# EAGLE schematic UNOWiFiREV2V4.0 (EAGLE 9.4.2)
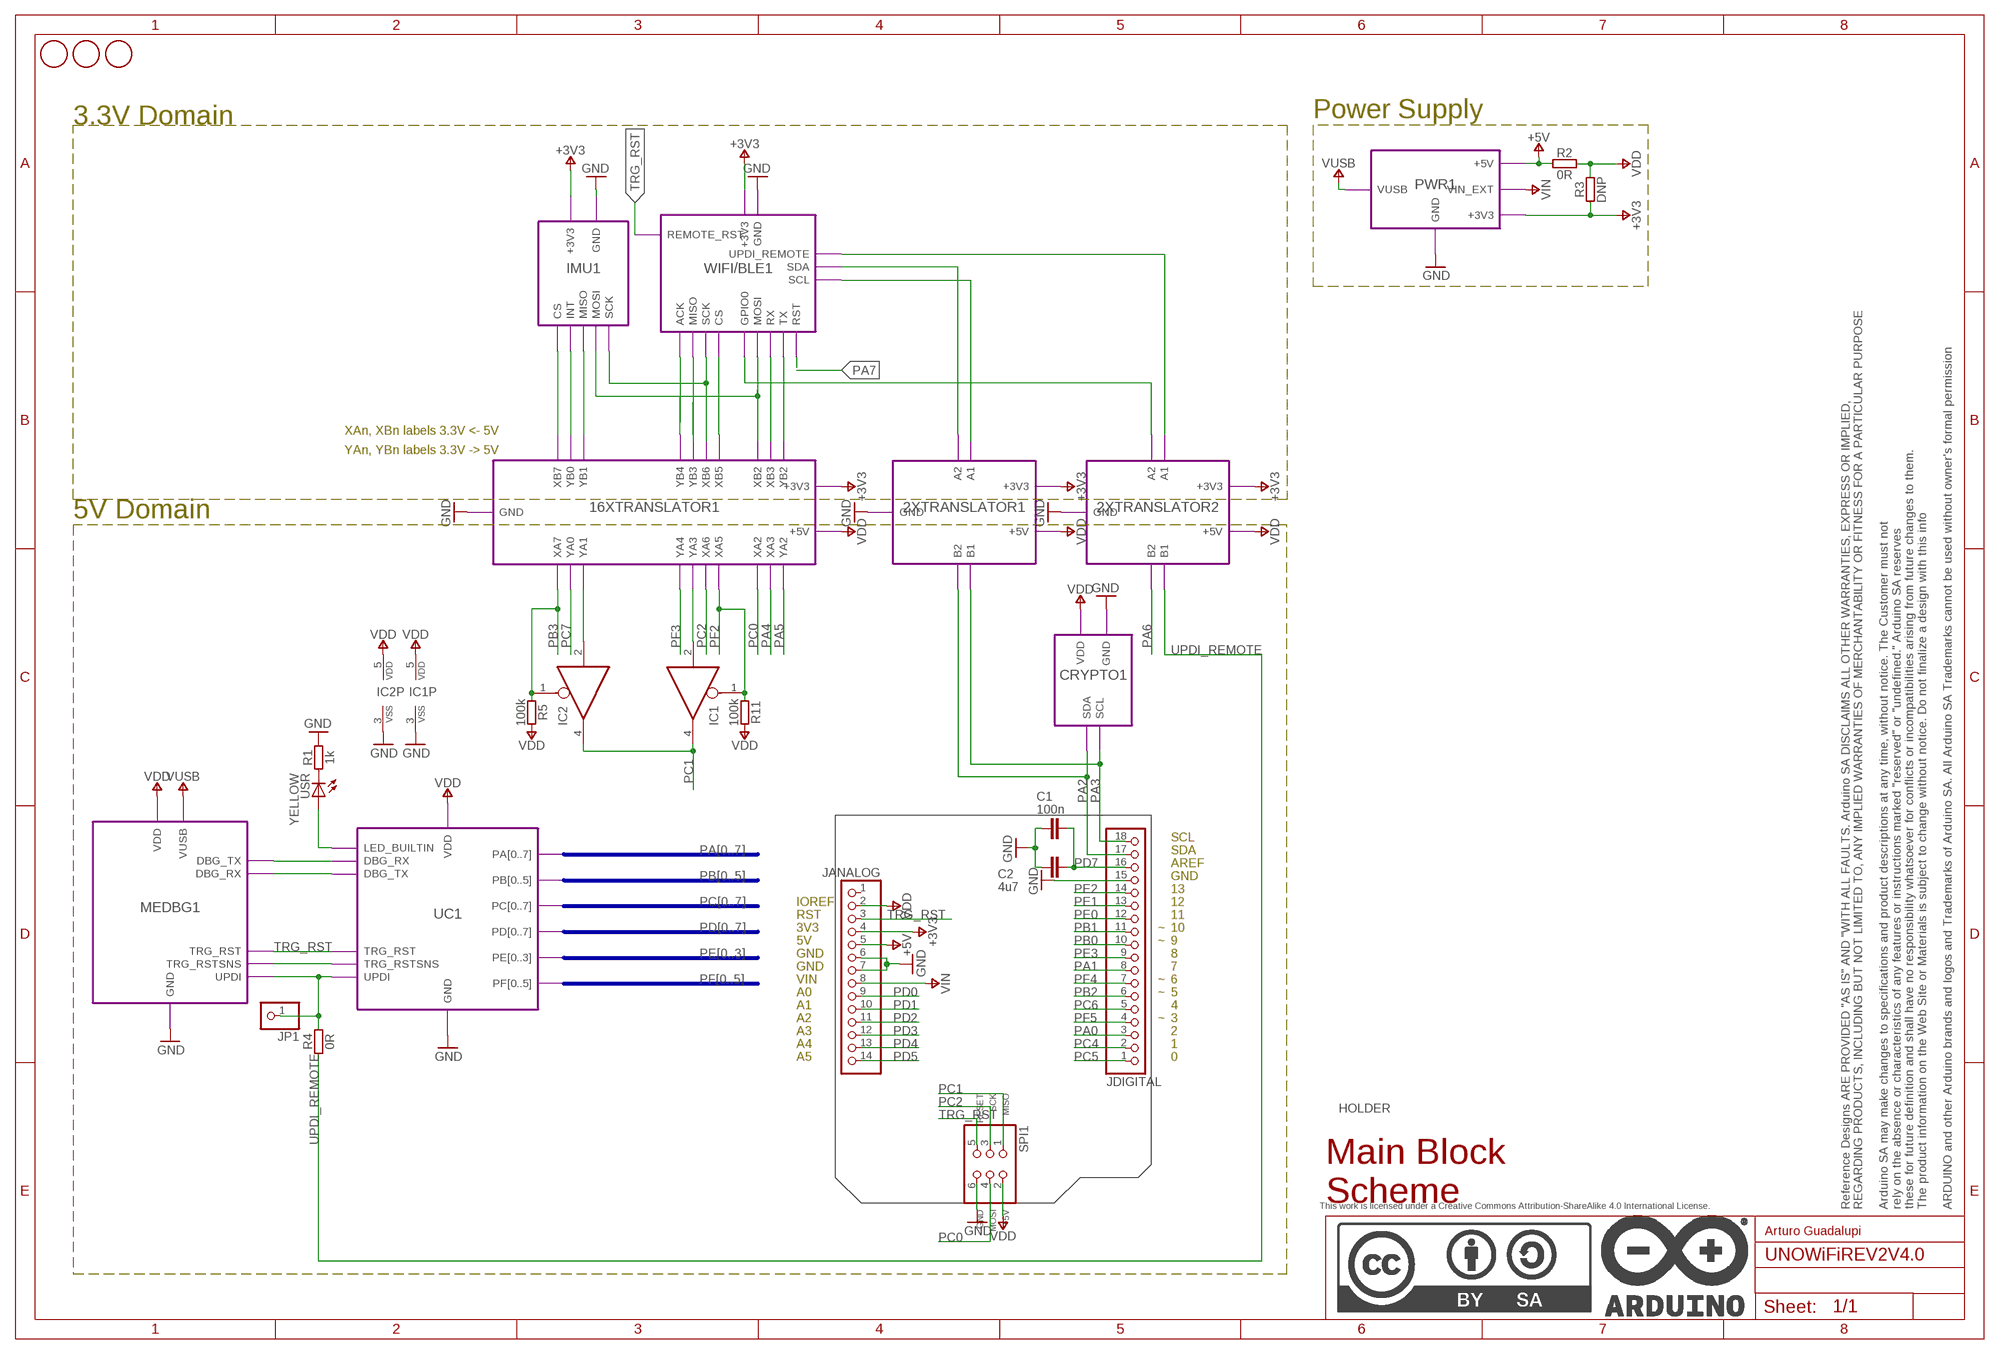
[diagram p0: schematic, sheet 1]

## Parts
C1  100n  C-100NF-0402  [0402-1005X55N]
C2  4u7  C-4.7UF-0402  [0402-1005X55N]
FD1  DNP  FIDUCIAL-2MM  [FD-1-2]
FD2  DNP  FIDUCIAL-2MM  [FD-1-2]
FD3  DNP  FIDUCIAL-2MM  [FD-1-2]
FRAME1  DNP  A3-FRAME  [FRAME]
HOLDER  HOLDER-UNOWIFI  [HOLDER]
IC1  74LVC1G125DCKR  SN74LVC1G125DCKR  [SC70-5]
IC2  74LVC1G125DCKR  SN74LVC1G125DCKR  [SC70-5]
JANALOG  -  PINHD-1X14-CUSTOM  [1X14_]
JDIGITAL  -  PINHD-1X18-CUSTOM  [1X18_]
JP1  PINHD-1X1  [1X01]
R1  1k  R-1K-0402  [0402-1005X55N]
R2  0R  R-0R-0603  [C0603]
R3  DNP  RDNP-0603  [C0603]
R4  0R  R-0R-0402  [0402-1005X55N]
R5  100k  R-100K-0402  [0402-1005X55N]
R11  100k  R-100K-0402  [0402-1005X55N]
SPI1  -  PINHD-2X03-ICSPTH  [2X03]
USR  YELLOW  LED-YELLOW-0603  [LEDC1608X80N-AK]

## Module instances
UC1 = UC (part numbers offset by 900)
CRYPTO1 = CRYPTO (part numbers offset by 700)
MEDBG1 = MEDBG (part numbers offset by 800)
IMU1 = IMU (part numbers offset by 200)
2XTRANSLATOR1 = 2XTRANSLATOR (part numbers offset by 600)
WIFI/BLE1 = WIFI/BLE (part numbers offset by 300)
PWR1 = PWR (part numbers offset by 100)
16XTRANSLATOR1 = 16XTRANSLATOR (part numbers offset by 500)
2XTRANSLATOR2 = 2XTRANSLATOR (part numbers offset by 400)

## Nets
+3V3: JANALOG.4 R3.1 ; port WIFI/BLE1.+3V3 2XTRANSLATOR1.+3V3 PWR1.+3V3 IMU1.+3V3 16XTRANSLATOR1.+3V3 2XTRANSLATOR2.+3V3
+5V: JANALOG.5 R2.1 ; port PWR1.+5V
GND: C1.2 C2.2 IC1.3(VSS) IC2.3(VSS) JANALOG.6 JANALOG.7 JDIGITAL.15 R1.2 SPI1.6 ; port WIFI/BLE1.GND CRYPTO1.GND PWR1.GND MEDBG1.GND UC1.GND IMU1.GND 16XTRANSLATOR1.GND 2XTRANSLATOR1.GND 2XTRANSLATOR2.GND
N$1: port 2XTRANSLATOR2.A1 WIFI/BLE1.UPDI_REMOTE
N$2: port WIFI/BLE1.MISO 16XTRANSLATOR1.YB3
N$3: port WIFI/BLE1.TX 16XTRANSLATOR1.YB2
N$4: port IMU1.MOSI WIFI/BLE1.MOSI 16XTRANSLATOR1.XB2
N$5: port WIFI/BLE1.RX 16XTRANSLATOR1.XB3
N$6: port IMU1.MISO 16XTRANSLATOR1.YB1
N$7: port WIFI/BLE1.GPIO0 2XTRANSLATOR2.A2
N$8: port WIFI/BLE1.CS 16XTRANSLATOR1.XB5
N$9: IC1.2(I) ; port 16XTRANSLATOR1.YA3 16XTRANSLATOR1.YA3
N$10: IC2.2(I) ; port 16XTRANSLATOR1.YA1
N$12: port WIFI/BLE1.SCL 2XTRANSLATOR1.A1
N$13: port WIFI/BLE1.SDA 2XTRANSLATOR1.A2
N$14: JP1.1 R4.2 ; port UC1.UPDI MEDBG1.UPDI
N$15: port IMU1.INT 16XTRANSLATOR1.YB0
N$16: port IMU1.CS 16XTRANSLATOR1.XB7
N$17: port UC1.TRG_RSTSNS MEDBG1.TRG_RSTSNS
N$18: port WIFI/BLE1.ACK 16XTRANSLATOR1.YB4
N$19: port UC1.DBG_TX MEDBG1.DBG_RX
N$20: port MEDBG1.DBG_TX UC1.DBG_RX
N$21: USR.A ; port UC1.LED_BUILTIN
N$22: R1.1 USR.C
N$23: port IMU1.SCK WIFI/BLE1.SCK 16XTRANSLATOR1.XB6
PA0: JDIGITAL.3
PA1: JDIGITAL.8
PA2: JDIGITAL.17 ; port CRYPTO1.SDA 2XTRANSLATOR1.B2
PA3: JDIGITAL.18 ; port CRYPTO1.SCL 2XTRANSLATOR1.B1
PA4: port 16XTRANSLATOR1.XA3
PA5: port 16XTRANSLATOR1.YA2
PA6: port 2XTRANSLATOR2.B2
PA7: port WIFI/BLE1.RST
PB0: JDIGITAL.10
PB1: JDIGITAL.11
PB2: JDIGITAL.6
PB3: IC2.1(OE) R5.1 ; port 16XTRANSLATOR1.XA7
PC0: SPI1.4 ; port 16XTRANSLATOR1.XA2
PC1: IC1.4(O) IC2.4(O) SPI1.1
PC2: SPI1.3 ; port 16XTRANSLATOR1.XA6
PC4: JDIGITAL.2
PC5: JDIGITAL.1
PC6: JDIGITAL.5
PC7: port 16XTRANSLATOR1.YA0
PD0: JANALOG.9
PD1: JANALOG.10
PD2: JANALOG.11
PD3: JANALOG.12
PD4: JANALOG.13
PD5: JANALOG.14
PD7: C1.1 C2.1 JDIGITAL.16
PE0: JDIGITAL.12
PE1: JDIGITAL.13
PE2: JDIGITAL.14
PE3: JDIGITAL.9
PF2: IC1.1(OE) R11.1 ; port 16XTRANSLATOR1.XA5
PF3: port 16XTRANSLATOR1.YA4
PF4: JDIGITAL.7
PF5: JDIGITAL.4
TRG_RST: JANALOG.3 SPI1.5 ; port MEDBG1.TRG_RST UC1.TRG_RST WIFI/BLE1.REMOTE_RST
UPDI_REMOTE: R4.1 ; port 2XTRANSLATOR2.B1
VDD: IC1.5(VDD) IC2.5(VDD) JANALOG.2 R2.2 R3.2 R5.2 R11.2 SPI1.2 ; port CRYPTO1.VDD MEDBG1.VDD UC1.VDD 16XTRANSLATOR1.+5V 2XTRANSLATOR1.+5V 2XTRANSLATOR2.+5V
VIN: JANALOG.8 ; port PWR1.VIN_EXT
VUSB: port PWR1.VUSB MEDBG1.VUSB
Unconnected: JANALOG.1

## Buses
PA[0..7]
PB[0..5]
PC[0..7]
PD[0..7]
PE[0..3]
PF[0..5]

## Notes on the sheet
- 3.3V Domain | Power Supply
- XAn, XBn labels 3.3V <- 5V
- YAn, YBn labels 3.3V -> 5V
- 5V Domain
- SCL
- SDA
- AREF
- GND
- 13
- IOREF | 12
- RST | 11
- 3V3 | ~ | 10
- 5V | ~ | 9
- GND | 8
- GND | 7
- VIN | ~ | 6
- A0 | ~ | 5
- A1 | 4
- A2 | ~ | 3
- A3 | 2
- A4 | 1
- A5 | 0
- Main Block 
  Scheme
- Arturo Guadalupi

## Library data of the parts
C1 = Arduino-rcl:C: SMD Capacitor; CODE-ARDUINO: 0132; DATASHEET: http://www.tdk.com/pdf/TDKMLCCCapRange.pdf; DISTRIBUTOR-LINK: http://www.digikey.com/product-detail/en/tdk-corporation/C1005X5R1H104K050BB/445-5942-1-ND/2443982; DISTRIBUTOR-PN: 445-5942-1-ND; MANUFACTURER: TDK; MANUFACTURER-PN: C1005X5R1H104K050BB; NOTE: -
C2 = Arduino-rcl:C: SMD Capacitor; CODE-ARDUINO: 0833; DATASHEET: http://search.murata.co.jp/Ceramy/image/img/A01X/partnumbering_e_01.pdf; DISTRIBUTOR-LINK: http://www.digikey.com/product-detail/en/murata-electronics-north-america/GRM155R60J475ME47D/490-5915-1-ND/3719860; DISTRIBUTOR-PN: 490-5915-1-ND; MANUFACTURER: Murata; MANUFACTURER-PN: GRM155R60J475ME47D; NOTE: -
FD1-FD3 = Arduino-utility:FIDUCIAL: Fiducial mount; CODE-ARDUINO: DNP; DATASHEET: DNP; DISTRIBUTOR-LINK: DNP; DISTRIBUTOR-PN: DNP; MANUFACTURER: DNP; MANUFACTURER-PN: DNP
FRAME1 = Arduino-utility:A3-FRAME; CODE-ARDUINO: DNP; DATASHEET: DNP; DISTRIBUTOR-LINK: DNP; DISTRIBUTOR-PN: DNP; MANUFACTURER: DNP; MANUFACTURER-PN: DNP; NOTE: DNP
HOLDER = Arduino-utility:HOLDER; CODE-ARDUINO: 2426; DESCRIPTION: DNP; DISTRIBUTOR-LINK: DNP; DISTRIBUTOR-PN: DNP; MANUFACTURER: DNP; MANUFACTURER-PN: DNP
IC1 IC2 = Arduino-ICs:SN74LVC1G125DCKR: Single bus buffer with 3-state output; CODE-ARDUINO: 0040; DATASHEET: http://www.ti.com/lit/ds/symlink/sn74lvc1g125.pdf; DISTRIBUTOR-LINK: https://www.digikey.com/product-detail/en/texas-instruments/SN74LVC1G125DCKR/296-11604-1-ND/385743; DISTRIBUTOR-PN: 296-11604-1-ND; MANUFACTURER: Texas Instruments; MANUFACTURER-PN: SN74LVC1G125DCKR; NOTE: NO
JANALOG = Arduino-connectors:PINHD-1X14: PIN HEADER; CODE-ARDUINO: 3649; DATASHEET: -; DISTRIBUTOR-LINK: -; DISTRIBUTOR-PN: -; MANUFACTURER: -; MANUFACTURER-PN: -; NOTE: -
JDIGITAL = Arduino-connectors:PINHD-1X18: Pin header; CODE-ARDUINO: 3648; DATASHEET: -; DISTRIBUTOR-LINK: -; DISTRIBUTOR-PN: -; MANUFACTURER: -; MANUFACTURER-PN: -; NOTE: -
JP1 = pinhead:PINHD-1X1: PIN HEADER
R1 = Arduino-rcl:R: SMD Resistor; CODE-ARDUINO: 0140; DATASHEET: www.yageo.com.tw/exep/pages/download/literatures/PYu-R_INT-thick_7.pdf; DISTRIBUTOR-LINK: http://www.digikey.com/product-detail/en/yageo/RC0402FR-071KL/311-1.00KLRCT-ND/729460; DISTRIBUTOR-PN: 311-1.00KLRCT-ND; MANUFACTURER: Yageo; MANUFACTURER-PN: RC0402FR-071KL; NOTE: NO
R2 = Arduino-rcl:R: SMD Resistor; CODE-ARDUINO: 0233; DATASHEET: http://www.yageo.com/exep/pages/download/literatures/PYu-R_Marking_2.pdf; DISTRIBUTOR-LINK: https://www.digikey.com/product-detail/en/yageo/RC0603JR-070RL/311-0.0GRCT-ND/729622; DISTRIBUTOR-PN: 311-0.0GRCT-ND; MANUFACTURER: Yageo; MANUFACTURER-PN: RC0603JR-070RL; NOTE: NO
R3 = Arduino-rcl:R: SMD Resistor; CODE-ARDUINO: DNP; DATASHEET: DNP; DISTRIBUTOR-LINK: DNP; DISTRIBUTOR-PN: DNP; MANUFACTURER: DNP; MANUFACTURER-PN: DNP; NOTE: DNP
R4 = Arduino-rcl:R: SMD Resistor; CODE-ARDUINO: 0039; DATASHEET: www.yageo.com.tw/exep/pages/download/literatures/PYu-R_INT-thick_7.pdf; DISTRIBUTOR-LINK: http://www.digikey.com/product-detail/en/yageo/RC0402FR-070RL/311-0.0LRCT-ND/2827888; DISTRIBUTOR-PN: 311-0.0LRCT-ND; MANUFACTURER: Yageo; MANUFACTURER-PN: RC0402FR-070RL; NOTE: NO
R5 R11 = Arduino-rcl:R: SMD Resistor; CODE-ARDUINO: 0134; DATASHEET: www.yageo.com.tw/exep/pages/download/literatures/PYu-R_INT-thick_7.pdf; DISTRIBUTOR-LINK: http://www.digikey.com/product-detail/en/yageo/RC0402FR-07100KL/311-100KLRCT-ND/729473; DISTRIBUTOR-PN: 311-100KLRCT-ND; MANUFACTURER: Yageo; MANUFACTURER-PN: RC0402FR-07100KL; NOTE: NO
SPI1 = Arduino-connectors:PINHD-2X03-ICSP: PIN HEADER; CODE-ARDUINO: 0114; DATASHEET: -; DISTRIBUTOR-LINK: https://www.digikey.com/product-detail/en/samtec-inc/TSW-103-25-S-D/TSW-103-25-S-D-ND/7863771; DISTRIBUTOR-PN: TSW-103-25-S-D-ND; MANUFACTURER: Samtec; MANUFACTURER-PN: TSW-103-25-S-D
USR = Arduino-diodes:LED: LED; CODE-ARDUINO: 2243; DATASHEET: http://media.digikey.com/pdf/Data%20Sheets/Avago%20PDFs/HSMz-Czzz.pdf; DISTRIBUTOR-LINK: http://www.digikey.com/product-detail/en/broadcom-limited/HSMY-C190/516-1424-1-ND/637748; DISTRIBUTOR-PN: 516-1424-1-ND; MANUFACTURER: Avago; MANUFACTURER-PN: HSMY-C190

## Module UC
Ports: TRG_RSTSNS(out) UPDI(in) TRG_RST(in) GND(pwr) VDD(pwr) DBG_TX(out) DBG_RX(in) LED_BUILTIN(out) PC[0..7](io) PA[0..7](io) PB[0..5](io) PD[0..7](io) PE[0..3](io) PF[0..5](io)
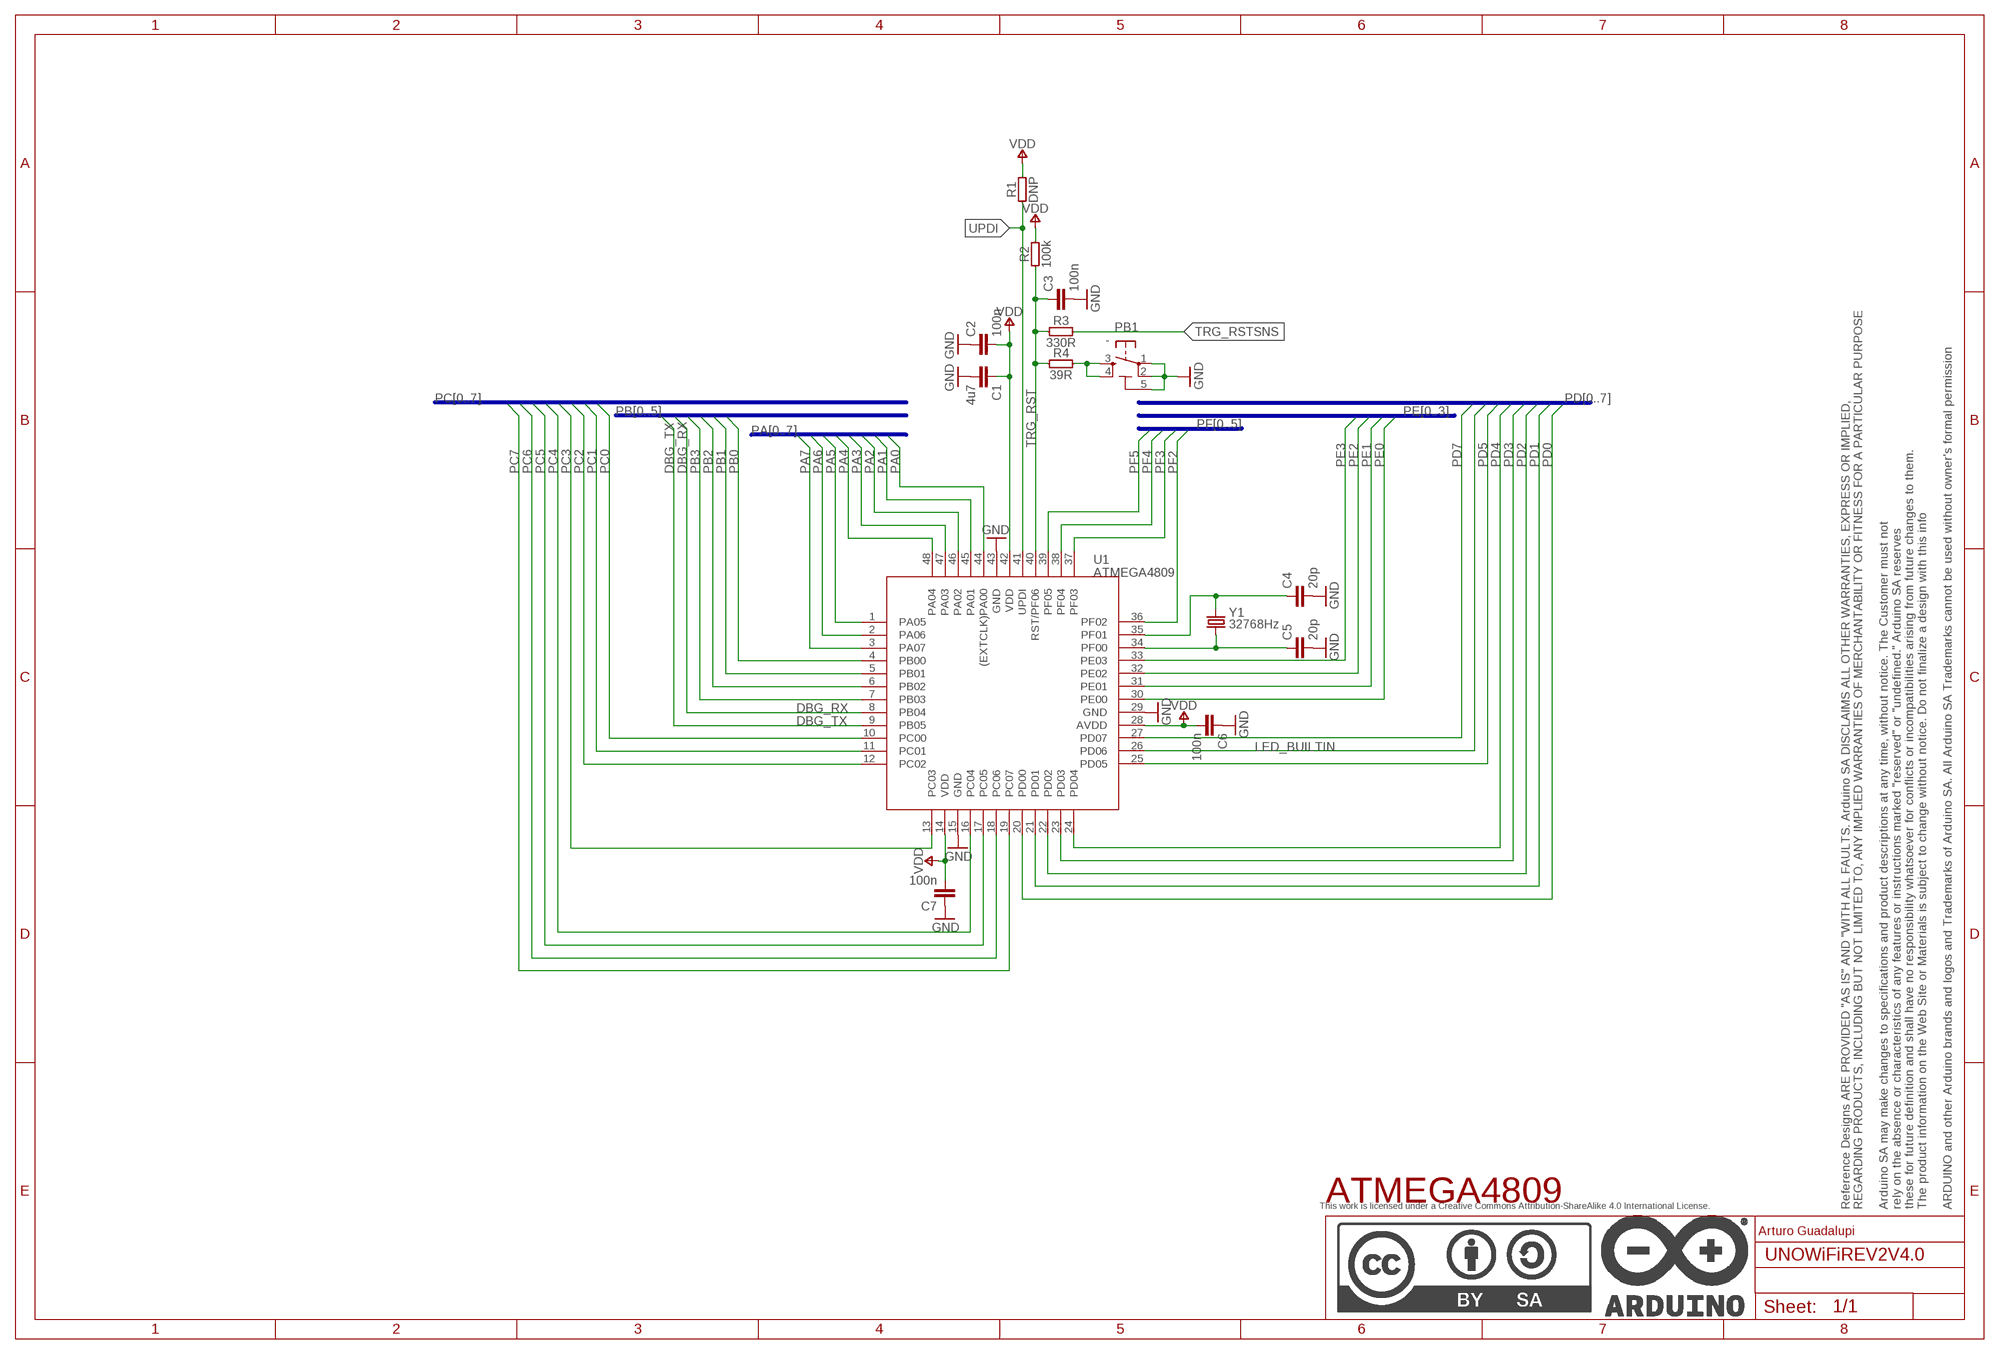
[diagram p1: schematic, module UC, sheet 1]

### Parts
C1  4u7  C-4.7UF-0402  [0402-1005X55N]
C2  100n  C-100NF-0402  [0402-1005X55N]
C3  100n  C-100NF-0402  [0402-1005X55N]
C4  20p  C-20PF-0402  [0402-1005X55N]
C5  20p  C-20PF-0402  [0402-1005X55N]
C6  100n  C-100NF-0402  [0402-1005X55N]
C7  100n  C-100NF-0402  [0402-1005X55N]
FRAME1  DNP  A3-FRAME  [FRAME]
PB1  -  TACTILE2  [TS42]
R1  DNP  R-DNP-0402  [0402-1005X55N]
R2  100k  R-100K-0402  [0402-1005X55N]
R3  330R  R-330R-0402  [0402-1005X55N]
R4  39R  R-39R-0402  [0402-1005X55N]
U1  ATMEGA4809  [TQFP48]
Y1  32768Hz  32.768KHZ  [ABS07]

### Nets
DBG_RX: U1.8(PB04)
DBG_TX: U1.9(PB05)
GND: C1.2 C2.1 C3.2 C4.2 C5.2 C6.1 C7.1 PB1.1 PB1.2 PB1.5(5-GND) U1.15(GND) U1.29(GND) U1.43(GND)
LED_BUILTIN: U1.26(PD06)
N$2: PB1.3 PB1.4 R4.2
N$3: C5.1 U1.34(PF00) Y1.1
N$4: C4.1 U1.35(PF01) Y1.2
PA0: U1.44((EXTCLK)PA00)
PA1: U1.45(PA01)
PA2: U1.46(PA02)
PA3: U1.47(PA03)
PA4: U1.48(PA04)
PA5: U1.1(PA05)
PA6: U1.2(PA06)
PA7: U1.3(PA07)
PB0: U1.4(PB00)
PB1: U1.5(PB01)
PB2: U1.6(PB02)
PB3: U1.7(PB03)
PC0: U1.10(PC00)
PC1: U1.11(PC01)
PC2: U1.12(PC02)
PC3: U1.13(PC03)
PC4: U1.16(PC04)
PC5: U1.17(PC05)
PC6: U1.18(PC06)
PC7: U1.19(PC07)
PD0: U1.20(PD00)
PD1: U1.21(PD01)
PD2: U1.22(PD02)
PD3: U1.23(PD03)
PD4: U1.24(PD04)
PD5: U1.25(PD05)
PD7: U1.27(PD07)
PE0: U1.30(PE00)
PE1: U1.31(PE01)
PE2: U1.32(PE02)
PE3: U1.33(PE03)
PF2: U1.36(PF02)
PF3: U1.37(PF03)
PF4: U1.38(PF04)
PF5: U1.39(PF05)
TRG_RST: C3.1 R2.1 R3.1 R4.1 U1.40(RST/PF06)
TRG_RSTSNS: R3.2
UPDI: R1.1 U1.41(UPDI)
VDD: C1.1 C2.2 C6.2 C7.2 R1.2 R2.2 U1.14(VDD) U1.28(AVDD) U1.42(VDD)

### Buses
PA[0..7]
PB[0..5]
PF[0..5]
PE[0..3]
PD[0..7]
PC[0..7]

### Notes on the sheet
- ATMEGA4809
- Arturo Guadalupi

### Library data of the parts
C1 = Arduino-rcl:C: SMD Capacitor; CODE-ARDUINO: 0833; DATASHEET: http://search.murata.co.jp/Ceramy/image/img/A01X/partnumbering_e_01.pdf; DISTRIBUTOR-LINK: http://www.digikey.com/product-detail/en/murata-electronics-north-america/GRM155R60J475ME47D/490-5915-1-ND/3719860; DISTRIBUTOR-PN: 490-5915-1-ND; MANUFACTURER: Murata; MANUFACTURER-PN: GRM155R60J475ME47D; NOTE: -
C2 C3 C6 C7 = Arduino-rcl:C: SMD Capacitor; CODE-ARDUINO: 0132; DATASHEET: http://www.tdk.com/pdf/TDKMLCCCapRange.pdf; DISTRIBUTOR-LINK: http://www.digikey.com/product-detail/en/tdk-corporation/C1005X5R1H104K050BB/445-5942-1-ND/2443982; DISTRIBUTOR-PN: 445-5942-1-ND; MANUFACTURER: TDK; MANUFACTURER-PN: C1005X5R1H104K050BB; NOTE: -
C4 C5 = Arduino-rcl:C: SMD Capacitor; CODE-ARDUINO: 2188; DATASHEET: http://www.kemet.com/docfinder?Partnumber=CBR04C200J5GAC; DISTRIBUTOR-LINK: http://www.digikey.com/product-detail/en/kemet/CBR04C200J5GAC/399-6173-1-ND/2732143; DISTRIBUTOR-PN: 399-6173-1-ND; MANUFACTURER: Kemet; MANUFACTURER-PN: CBR04C200J5GAC; NOTE: -
FRAME1 = Arduino-utility:A3-FRAME; CODE-ARDUINO: DNP; DATASHEET: DNP; DISTRIBUTOR-LINK: DNP; DISTRIBUTOR-PN: DNP; MANUFACTURER: DNP; MANUFACTURER-PN: DNP; NOTE: DNP
PB1 = Arduino-pushbuttons:TACTILE2: Pushbutton; CODE-ARDUINO: 0946; DATASHEET: http://www.mouser.com/ds/2/418/NG_CD_1571636_C1-122399.pdf; DISTRIBUTOR-LINK: https://www.mouser.it/ProductDetail/TE-Connectivity/1571636-3/?qs=%2fha2pyFaduiys%2fNUBzym%252bcoSb9tuK3Sjuv54qjf0hQ0%3d; DISTRIBUTOR-PN: 506-1571636-3; MANUFACTURER: TE; MANUFACTURER-PN: 1571636-3; PN-ALTERNATIVE1: TS42031-160WWS027260
R1 = Arduino-rcl:R: SMD Resistor; CODE-ARDUINO: DNP; DATASHEET: DNP; DISTRIBUTOR-LINK: DNP; DISTRIBUTOR-PN: DNP; MANUFACTURER: DNP; MANUFACTURER-PN: DNP; NOTE: NO
R2 = Arduino-rcl:R: SMD Resistor; CODE-ARDUINO: 0134; DATASHEET: www.yageo.com.tw/exep/pages/download/literatures/PYu-R_INT-thick_7.pdf; DISTRIBUTOR-LINK: http://www.digikey.com/product-detail/en/yageo/RC0402FR-07100KL/311-100KLRCT-ND/729473; DISTRIBUTOR-PN: 311-100KLRCT-ND; MANUFACTURER: Yageo; MANUFACTURER-PN: RC0402FR-07100KL; NOTE: NO
R3 = Arduino-rcl:R: SMD Resistor; CODE-ARDUINO: 2229; DATASHEET: www.yageo.com.tw/exep/pages/download/literatures/PYu-R_INT-thick_7.pdf; DISTRIBUTOR-LINK: http://www.digikey.com/product-detail/en/yageo/RC0402FR-07330RL/311-330LRCT-ND/729541; DISTRIBUTOR-PN: 311-330LRCT-ND; MANUFACTURER: Yageo; MANUFACTURER-PN: RC0402FR-07330RL; NOTE: NO
R4 = Arduino-rcl:R: SMD Resistor; CODE-ARDUINO: 0138; DATASHEET: www.yageo.com.tw/exep/pages/download/literatures/PYu-R_INT-thick_7.pdf; DISTRIBUTOR-LINK: http://www.digikey.com/product-detail/en/yageo/RC0402FR-0739RL/311-39.0LRCT-ND/729549; DISTRIBUTOR-PN: 311-39.0LRCT-ND; MANUFACTURER: Yageo; MANUFACTURER-PN: RC0402FR-0739RL; NOTE: NO
U1 = Arduino-ucs&SoCs:ATMEGA4809: ATMEGA4809; CODE-ARDUINO: ATMEGA4809; DATASHEET: http://ww1.microchip.com/downloads/en/DeviceDoc/40002016A.pdf; DISTRIBUTOR-LINK: https://www.digikey.com/product-detail/en/microchip-technology/ATMEGA4809-AFR/ATMEGA4809-AFRCT-ND/8540756; DISTRIBUTOR-PN: ATMEGA4809-AFRCT-ND; MANUFACTURER: Microchip; MANUFACTURER-PN: ATMEGA4809-AFR
Y1 = Arduino-crystals:32.768KHZ: LF crystal; CODE-ARDUINO: 0213; DATASHEET: http://www.abracon.com/Resonators/ABS07.pdf; DISTRIBUTOR-LINK: http://www.digikey.com/product-detail/en/abracon-llc/ABS07-32.768KHZ-T/535-9542-1-ND/1237009; DISTRIBUTOR-PN: 535-9542-1-ND; MANUFACTURER: Abracon LLC; MANUFACTURER-PN: ABS07-32.768KHZ-T

## Module CRYPTO
Ports: SDA(io) SCL(in) GND(pwr) VDD(pwr)
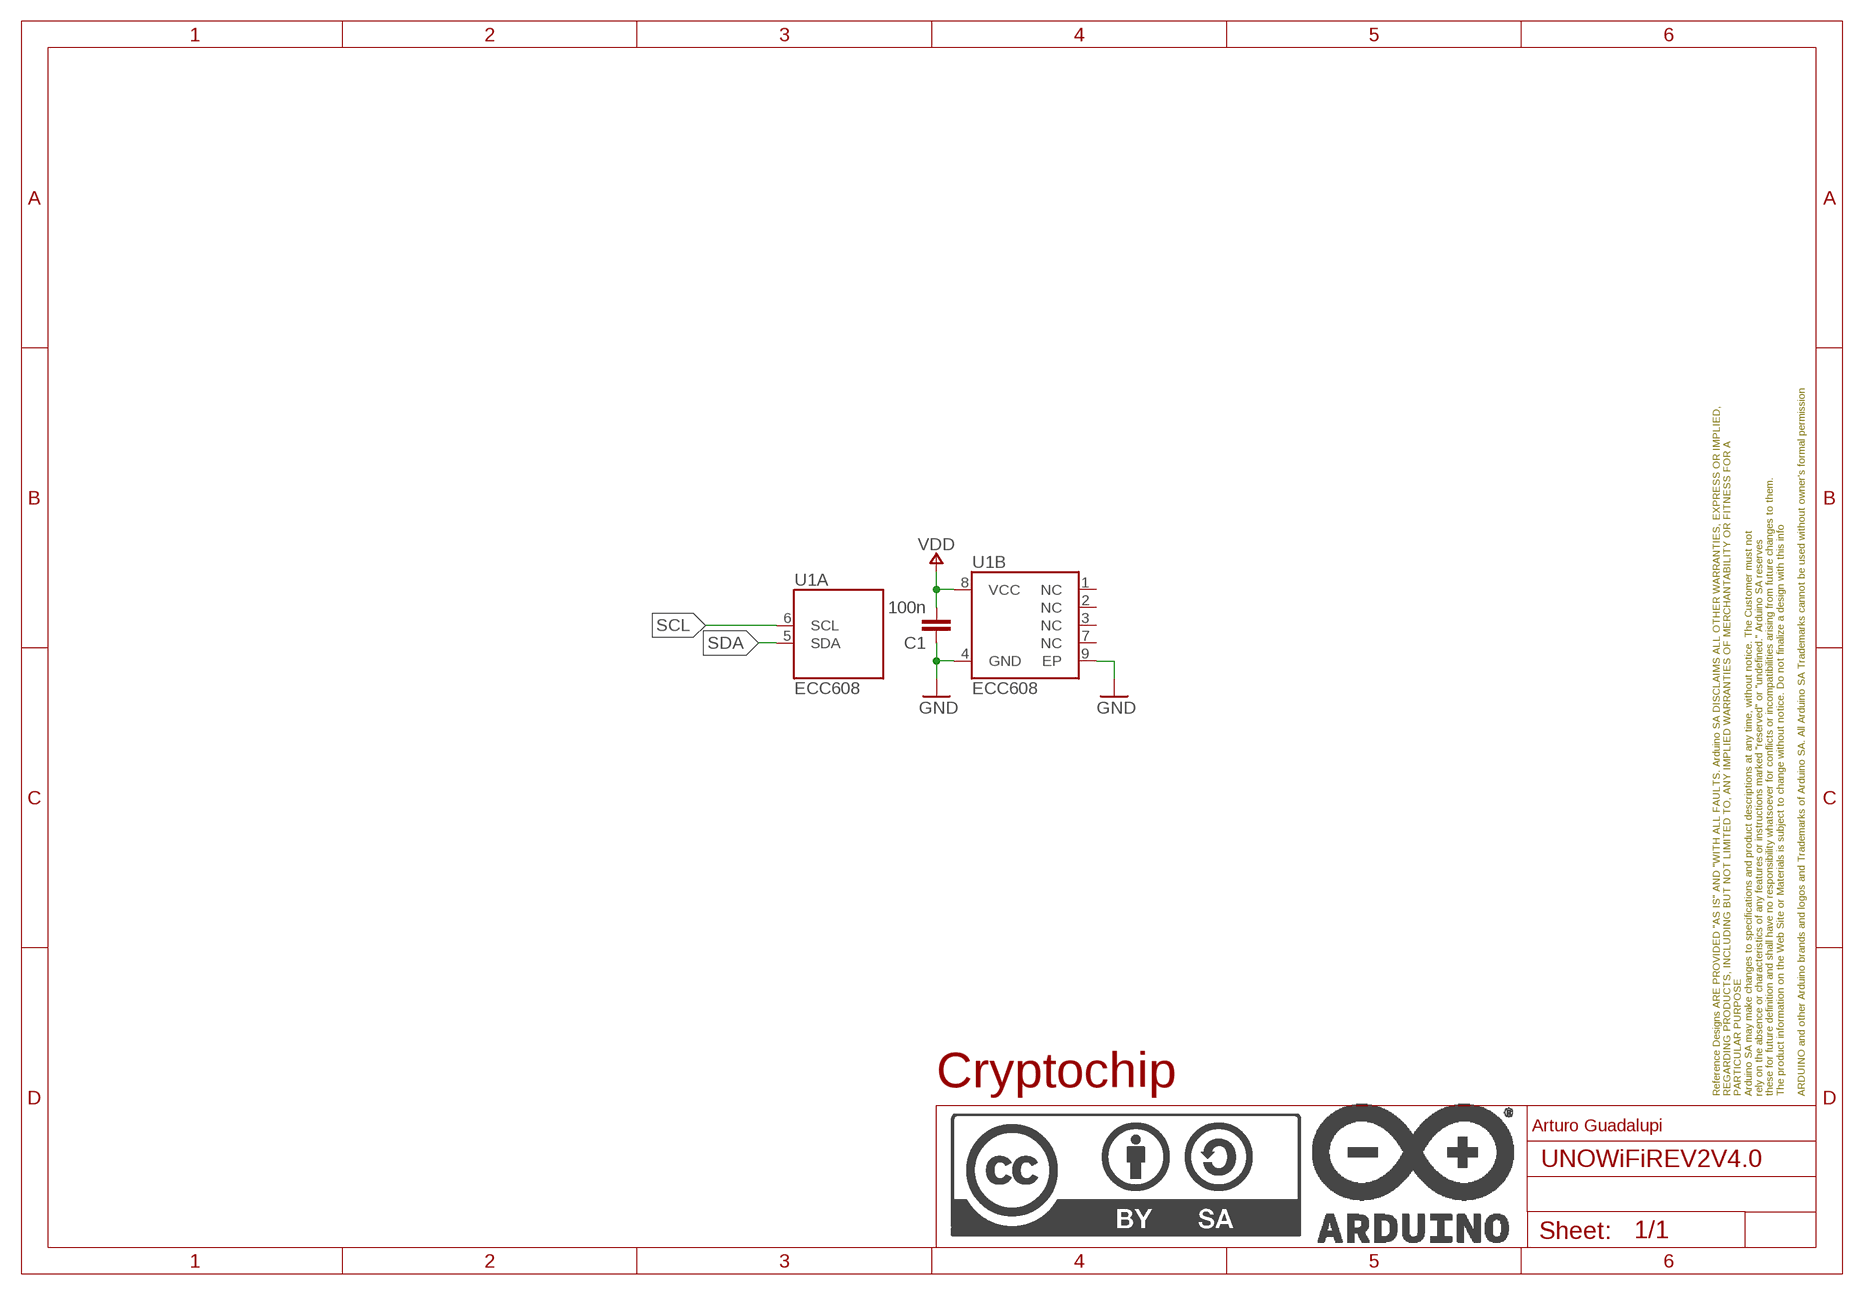
[diagram p2: schematic, module CRYPTO, sheet 1]

### Parts
C1  100n  C-100NF-0402  [0402-1005X55N]
FRAME1  DNP  A4L-LOC  [FRAME]
U1  ECC608  ATECC-6088-UDFN  [SON50P300X200X60-9N-EP160X140]

### Nets
GND: C1.1 U1.4(B:GND) U1.9(B:EP)
SCL: U1.6(A:SCL)
SDA: U1.5(A:SDA)
VDD: C1.2 U1.8(B:VCC)
Unconnected: U1.1(B:NC) U1.2(B:NC) U1.3(B:NC) U1.7(B:NC)

### Notes on the sheet
- Cryptochip
- Arturo Guadalupi

### Library data of the parts
C1 = Arduino-rcl:C: SMD Capacitor; CODE-ARDUINO: 0132; DATASHEET: http://www.tdk.com/pdf/TDKMLCCCapRange.pdf; DISTRIBUTOR-LINK: http://www.digikey.com/product-detail/en/tdk-corporation/C1005X5R1H104K050BB/445-5942-1-ND/2443982; DISTRIBUTOR-PN: 445-5942-1-ND; MANUFACTURER: TDK; MANUFACTURER-PN: C1005X5R1H104K050BB; NOTE: -
FRAME1 = Arduino-utility:A4L-LOC; CODE-ARDUINO: DNP; DATASHEET: DNP; DISTRIBUTOR-LINK: DNP; DISTRIBUTOR-PN: DNP; MANUFACTURER: DNP; MANUFACTURER-PN: DNP; NOTE: DNP
U1 = Arduino-ICs:ATECC: Secure authentication and product validation device, EEPROM, I2C, 2.0 - 5.5V; CODE-ARDUINO: ATECC608A-MAHDA-T; DATASHEET: http://ww1.microchip.com/downloads/en/DeviceDoc/40001977A.pdf; DISTRIBUTOR-LINK: https://www.digikey.com/product-detail/en/microchip-technology/ATECC608A-MAHDA-T/ATECC608A-MAHDA-TCT-ND/7928236; DISTRIBUTOR-PN: ATECC608A-MAHDA-TCT-ND; MANUFACTURER: Microchip; MANUFACTURER-PN: ATECC608A-MAHDA-T; NOTE: NO

## Module MEDBG
Ports: VDD(pwr) VUSB(pwr) GND(pwr) DBG_TX(out) DBG_RX(in) TRG_RSTSNS(in) TRG_RST(out) UPDI(out)
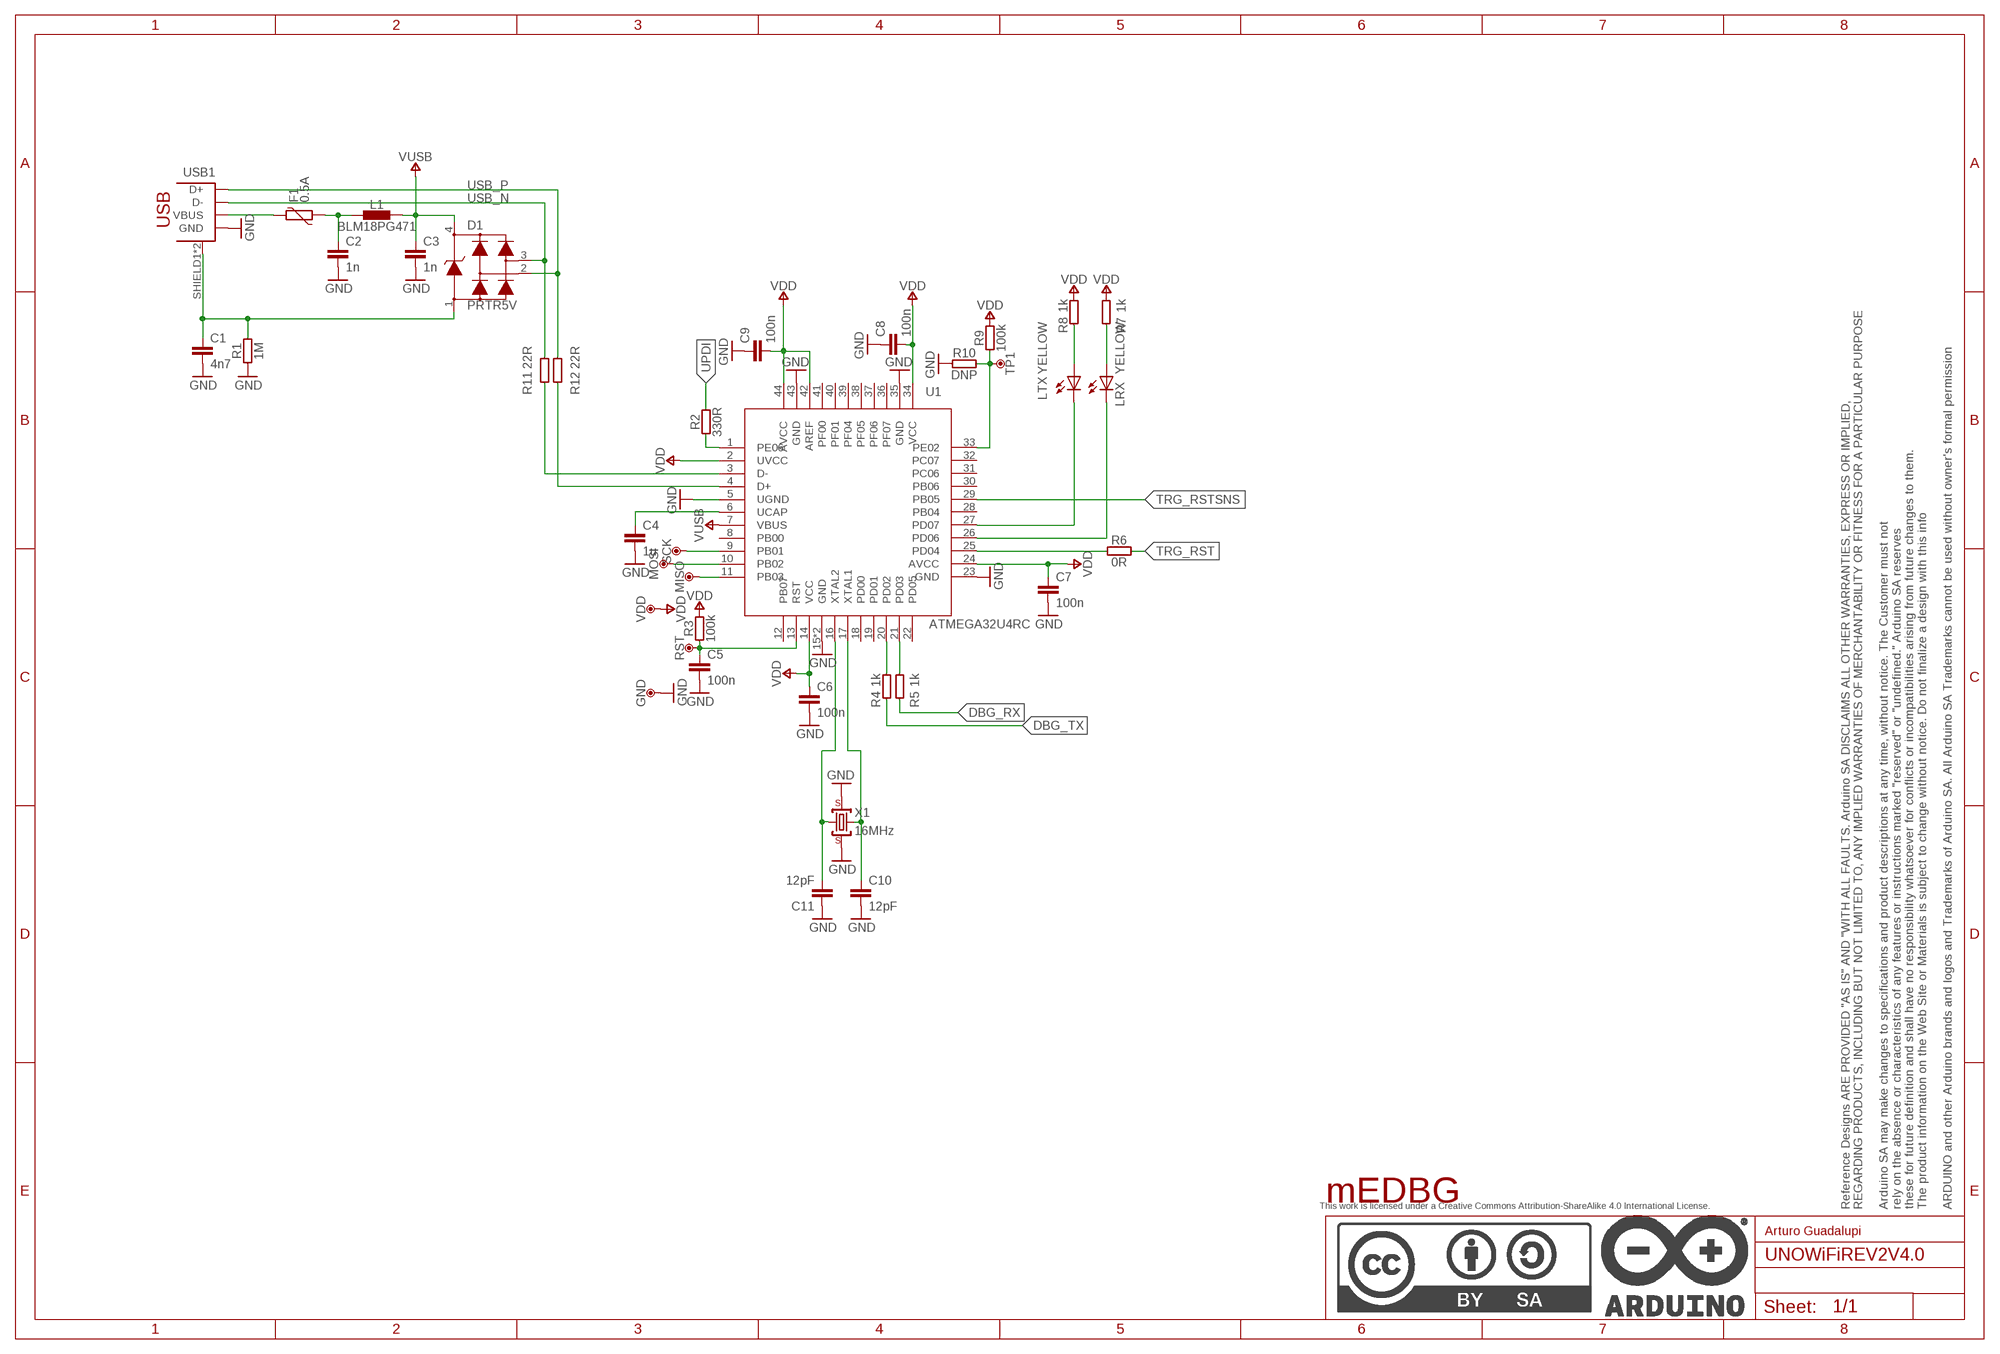
[diagram p3: schematic, module MEDBG, sheet 1]

### Parts
C1  4n7  C4.7NF-0805  [0805-R2013X50N]
C2  1n  C-1NF-0402  [0402-1005X55N]
C3  1n  C-1NF-0402  [0402-1005X55N]
C4  1u  C-1UF-0402  [0402-1005X55N]
C5  100n  C-100NF-0402  [0402-1005X55N]
C6  100n  C-100NF-0402  [0402-1005X55N]
C7  100n  C-100NF-0402  [0402-1005X55N]
C8  100n  C-100NF-0402  [0402-1005X55N]
C9  100n  C-100NF-0402  [0402-1005X55N]
C10  12pF  C-12PF-0402  [0402-1005X55N]
C11  12pF  C-12PF-0402  [0402-1005X55N]
D1  PRTR5V  PRTR5V0U2X,215  [SOT190P230X110-4N]
F1  0.5A  PTC0.5A0603  [0603-1608X90N]
FRAME1  DNP  A3-FRAME  [FRAME]
GND  DNP  TPTP-1.00MM  [TP-1.00MM]
L1  BLM18PG471  FERRITE-470R0603  [0603-1608X90N]
LRX  YELLOW  LED-YELLOW-0603  [LEDC1608X80N-AK]
LTX  YELLOW  LED-YELLOW-0603  [LEDC1608X80N-AK]
MISO  DNP  TPTP-1.00MM  [TP-1.00MM]
MOSI  DNP  TPTP-1.00MM  [TP-1.00MM]
R1  1M  R-1M-0402  [0402-1005X55N]
R2  330R  R-330R-0402  [0402-1005X55N]
R3  100k  R-100K-0402  [0402-1005X55N]
R4  1k  R-1K-0402  [0402-1005X55N]
R5  1k  R-1K-0402  [0402-1005X55N]
R6  0R  R-0R-0402  [0402-1005X55N]
R7  1k  R-1K-0402  [0402-1005X55N]
R8  1k  R-1K-0402  [0402-1005X55N]
R9  100k  R-100K-0402  [0402-1005X55N]
R10  DNP  R-DNP-0402  [0402-1005X55N]
R11  22R  R-22R-0402  [0402-1005X55N]
R12  22R  R-22R-0402  [0402-1005X55N]
RST  DNP  TPTP-1.00MM  [TP-1.00MM]
SCK  DNP  TPTP-1.00MM  [TP-1.00MM]
TP1  DNP  TPTP-1.27MM  [TP-1.27MM]
U1  ATMEGA32U4RC  ATMEGA32U4  [QFN50P700X700X100-45N]
USB1  -  USB-B-H  [USB-B-H]
VDD  DNP  TPTP-1.00MM  [TP-1.00MM]
X1  16MHz  CRYSTAL-3.2X2.5-16MHZ(12PF)  [CRYSTAL-3.2-2.5]

### Nets
DBG_RX: R5.1
DBG_TX: R4.1
GND: C1.2 C2.2 C3.2 C4.2 C5.2 C6.2 C7.2 C8.1 C9.1 C10.2 C11.1 GND.X R1.1 R10.1 U1.5(UGND) U1.15(GND) U1.23(GND) U1.35(GND) U1.43(GND) U1.45(GND) USB1.GND X1.2(GND) X1.4(GND)
N$1: C1.1 D1.1 R1.2 USB1.SHIELD1(SHIELD) USB1.SHIELD2(SHIELD)
N$2: F1.2 USB1.VBUS
N$3: C2.1 F1.1 L1.1
N$4: R2.1 U1.1(PE06)
N$5: C4.1 U1.6(UCAP)
N$6: C5.1 R3.1 RST.X U1.13(RST)
N$7: C11.2 U1.16(XTAL2) X1.1(C1)
N$8: C10.1 U1.17(XTAL1) X1.3(C2)
N$9: R4.2 U1.20(PD02)
N$10: R5.2 U1.21(PD03)
N$11: LTX.C U1.27(PD07)
N$12: R6.1 U1.25(PD04)
N$13: LRX.C U1.26(PD06)
N$14: LTX.A R8.1
N$15: LRX.A R7.1
N$16: R9.1 R10.2 TP1.X U1.33(PE02)
N$17: MISO.X U1.11(PB03)
N$18: MOSI.X U1.10(PB02)
N$19: SCK.X U1.9(PB01)
TRG_RST: R6.2
TRG_RSTSNS: U1.29(PB05)
UPDI: R2.2
USB2_N: R11.1 U1.3(D-)
USB2_PI: R12.1 U1.4(D+)
USB_N: D1.3 R11.2 USB1.D-
USB_P: D1.2 R12.2 USB1.D+
VDD: C6.1 C7.1 C8.2 C9.2 R3.2 R7.2 R8.2 R9.2 U1.2(UVCC) U1.14(VCC) U1.24(AVCC) U1.34(VCC) U1.42(AREF) U1.44(AVCC) VDD.X
VUSB: C3.1 D1.4 L1.2 U1.7(VBUS)
Unconnected: U1.8(PB00) U1.12(PB07) U1.18(PD00) U1.19(PD01) U1.22(PD05) U1.28(PB04) U1.30(PB06) U1.31(PC06) U1.32(PC07) U1.36(PF07) U1.37(PF06) U1.38(PF05) U1.39(PF04) U1.40(PF01) U1.41(PF00)

### Notes on the sheet
- mEDBG
- Arturo Guadalupi

### Library data of the parts
C1 = Arduino-rcl:C: SMD Capacitor; CODE-ARDUINO: 0689; DATASHEET: http://www.kemet.com/Lists/ProductCatalog/Attachments/40/KEM_C1010_X7R_HV_SMD.pdf; DISTRIBUTOR-LINK: www.kemet.com/docfinder?Partnumber=C0805C472KDRACTU; DISTRIBUTOR-PN: 399-6738-1-ND; MANUFACTURER: Kemet; MANUFACTURER-PN: C0805C472KDRACTU; NOTE: -
C2 C3 = Arduino-rcl:C: SMD Capacitor; CODE-ARDUINO: 2321; DATASHEET: http://www.samsungsem.com/kr/support/product-search/mlcc/__icsFiles/afieldfile/2016/08/18/S_CL05B102KB5NNNC.pdf; DISTRIBUTOR-LINK: http://www.digikey.com/product-detail/en/samsung-electro-mechanics-america-inc/CL05B102KB5NNNC/1276-1032-1-ND/3889118; DISTRIBUTOR-PN: 1276-1032-1-ND; MANUFACTURER: Samsung; MANUFACTURER-PN: CL05B102KB5NNNC; NOTE: -
C4 = Arduino-rcl:C: SMD Capacitor; CODE-ARDUINO: 0133; DATASHEET: http://search.murata.co.jp/Ceramy/image/img/A01X/partnumbering_e_01.pdf; DISTRIBUTOR-LINK: http://www.digikey.com/product-detail/en/murata-electronics-north-america/GRM155R61E105KA12D/490-10017-1-ND/5026367; DISTRIBUTOR-PN: 490-10017-1-ND; MANUFACTURER: Murata; MANUFACTURER-PN: GRM155R61E105KA12D; NOTE: -
C5-C9 = Arduino-rcl:C: SMD Capacitor; CODE-ARDUINO: 0132; DATASHEET: http://www.tdk.com/pdf/TDKMLCCCapRange.pdf; DISTRIBUTOR-LINK: http://www.digikey.com/product-detail/en/tdk-corporation/C1005X5R1H104K050BB/445-5942-1-ND/2443982; DISTRIBUTOR-PN: 445-5942-1-ND; MANUFACTURER: TDK; MANUFACTURER-PN: C1005X5R1H104K050BB; NOTE: -
C10 C11 = Arduino-rcl:C: SMD Capacitor; CODE-ARDUINO: A5006; DATASHEET: http://search.murata.co.jp/Ceramy/image/img/A01X/partnumbering_e_01.pdf; DISTRIBUTOR-LINK: https://www.digikey.com/product-detail/en/murata-electronics-north-america/GJM1555C1H120GB01D/490-8078-1-ND/4380364; DISTRIBUTOR-PN: 490-8078-1-ND; MANUFACTURER: Murata; MANUFACTURER-PN: GJM1555C1H120GB01D; NOTE: -
D1 = Arduino-diodes:PRTR5V0U2X,215: USB ESD protection; CODE-ARDUINO: 2209; DATASHEET: http://www.nxp.com/documents/data_sheet/PRTR5V0U2X.pdf; DISTRIBUTOR-LINK: http://www.digikey.com/product-detail/en/nxp-semiconductors/PRTR5V0U2X,215/568-4140-1-ND/1589981; DISTRIBUTOR-PN: 568-4140-1-ND; MANUFACTURER: NXP; MANUFACTURER-PN: PRTR5V0U2X,215
F1 = Arduino-rcl:PTC: SMD PTC; CODE-ARDUINO: 2217; DATASHEET: http://www.bourns.com/docs/Product-Datasheets/mffsmf.pdf; DISTRIBUTOR-LINK: http://www.digikey.com/product-detail/en/bourns-inc/MF-FSMF050X-2/MF-FSMF050X-2CT-ND/2039389; DISTRIBUTOR-PN: MF-FSMF050X-2CT-ND; MANUFACTURER: Bourns Inc; MANUFACTURER-PN: F-FSMF050X-2; NOTE: IHOLD = 0.5A
FRAME1 = Arduino-utility:A3-FRAME; CODE-ARDUINO: DNP; DATASHEET: DNP; DISTRIBUTOR-LINK: DNP; DISTRIBUTOR-PN: DNP; MANUFACTURER: DNP; MANUFACTURER-PN: DNP; NOTE: DNP
GND MISO MOSI RST SCK TP1 VDD = Arduino-utility:TP: Testpoint; CODE-ARDUINO: DNP; DATASHEET: DNP; DISTRIBUTOR-LINK: DNP; DISTRIBUTOR-PN: DNP; MANUFACTURER: DNP; MANUFACTURER-PN: DNP
L1 = Arduino-rcl:FERRITE: SMD ferrite; CODE-ARDUINO: 2200; DATASHEET: http://search.murata.co.jp/Ceramy/image/img/PDF/ENG/L0110S0100BLM18P.pdf; DISTRIBUTOR-LINK: http://www.digikey.com/product-detail/en/murata-electronics-north-america/BLM18PG471SN1D/490-5223-1-ND/1948399; DISTRIBUTOR-PN: 490-5223-1-ND; MANUFACTURER: Murata; MANUFACTURER-PN: BLM18PG471SN1D; NOTE: -
LRX LTX = Arduino-diodes:LED: LED; CODE-ARDUINO: 2243; DATASHEET: http://media.digikey.com/pdf/Data%20Sheets/Avago%20PDFs/HSMz-Czzz.pdf; DISTRIBUTOR-LINK: http://www.digikey.com/product-detail/en/broadcom-limited/HSMY-C190/516-1424-1-ND/637748; DISTRIBUTOR-PN: 516-1424-1-ND; MANUFACTURER: Avago; MANUFACTURER-PN: HSMY-C190
R1 = Arduino-rcl:R: SMD Resistor; CODE-ARDUINO: 0139; DATASHEET: www.yageo.com.tw/exep/pages/download/literatures/PYu-R_INT-thick_7.pdf; DISTRIBUTOR-LINK: http://www.digikey.com/product-detail/en/yageo/RC0402JR-07330RL/311-330JRCT-ND/729412; DISTRIBUTOR-PN: 311-330JRCT-ND; MANUFACTURER: Yageo; MANUFACTURER-PN: RC0402JR-07330RL; NOTE: NO
R2 = Arduino-rcl:R: SMD Resistor; CODE-ARDUINO: 2229; DATASHEET: www.yageo.com.tw/exep/pages/download/literatures/PYu-R_INT-thick_7.pdf; DISTRIBUTOR-LINK: http://www.digikey.com/product-detail/en/yageo/RC0402FR-07330RL/311-330LRCT-ND/729541; DISTRIBUTOR-PN: 311-330LRCT-ND; MANUFACTURER: Yageo; MANUFACTURER-PN: RC0402FR-07330RL; NOTE: NO
R3 R9 = Arduino-rcl:R: SMD Resistor; CODE-ARDUINO: 0134; DATASHEET: www.yageo.com.tw/exep/pages/download/literatures/PYu-R_INT-thick_7.pdf; DISTRIBUTOR-LINK: http://www.digikey.com/product-detail/en/yageo/RC0402FR-07100KL/311-100KLRCT-ND/729473; DISTRIBUTOR-PN: 311-100KLRCT-ND; MANUFACTURER: Yageo; MANUFACTURER-PN: RC0402FR-07100KL; NOTE: NO
R4 R5 R7 R8 = Arduino-rcl:R: SMD Resistor; CODE-ARDUINO: 0140; DATASHEET: www.yageo.com.tw/exep/pages/download/literatures/PYu-R_INT-thick_7.pdf; DISTRIBUTOR-LINK: http://www.digikey.com/product-detail/en/yageo/RC0402FR-071KL/311-1.00KLRCT-ND/729460; DISTRIBUTOR-PN: 311-1.00KLRCT-ND; MANUFACTURER: Yageo; MANUFACTURER-PN: RC0402FR-071KL; NOTE: NO
R6 = Arduino-rcl:R: SMD Resistor; CODE-ARDUINO: 0039; DATASHEET: www.yageo.com.tw/exep/pages/download/literatures/PYu-R_INT-thick_7.pdf; DISTRIBUTOR-LINK: http://www.digikey.com/product-detail/en/yageo/RC0402FR-070RL/311-0.0LRCT-ND/2827888; DISTRIBUTOR-PN: 311-0.0LRCT-ND; MANUFACTURER: Yageo; MANUFACTURER-PN: RC0402FR-070RL; NOTE: NO
R10 = Arduino-rcl:R: SMD Resistor; CODE-ARDUINO: DNP; DATASHEET: DNP; DISTRIBUTOR-LINK: DNP; DISTRIBUTOR-PN: DNP; MANUFACTURER: DNP; MANUFACTURER-PN: DNP; NOTE: NO
R11 R12 = Arduino-rcl:R: SMD Resistor; CODE-ARDUINO: 0468; DATASHEET: www.yageo.com.tw/exep/pages/download/literatures/PYu-R_INT-thick_7.pdf; DISTRIBUTOR-LINK: http://www.digikey.com/products/en?keywords=311-22.0LRCT-ND; DISTRIBUTOR-PN: 311-22.0LRCT-ND; MANUFACTURER: Yageo; MANUFACTURER-PN: RC0402FR-0722RL; NOTE: NO
U1 = Arduino-ucs&SoCs:ATMEGA32U4: ATMEGA32U4; CODE-ARDUINO: ATMEGA32u4; DATASHEET: http://ww1.microchip.com/downloads/en/DeviceDoc/Atmel-7766-8-bit-AVR-ATmega16U4-32U4_Datasheet.pdf; DISTRIBUTOR-LINK: https://www.digikey.com/product-detail/en/microchip-technology/ATMEGA32U4RC-MU/ATMEGA32U4RC-MU-ND/2507984; DISTRIBUTOR-PN: ATMEGA32U4RC-MU-ND; MANUFACTURER: Microchip; MANUFACTURER-PN: ATMEGA32U4RC-MU
USB1 = Arduino-connectors:USB: USB Connectors; CODE-ARDUINO: 0056; DATASHEET: http://cnctech.us/pdfs/1001-003-02000.pdf; DISTRIBUTOR-LINK: https://www.digikey.com/products/it?keywords=1001-003-02000; DISTRIBUTOR-PN: 1175-1002-ND; MANUFACTURER: CNC Tech; MANUFACTURER-PN: 1001-003-02000; PN-ALTERNATIVE1: USB-B-S-RA-WT-SPCC
X1 = Arduino-crystals:CRYSTAL-3.2X2.5: Crystal SMD 3.2x2.5mm; CODE-ARDUINO: 0395; DATASHEET: https://www.ecsxtal.com/store/pdf/ECX-33Q.pdf; DISTRIBUTOR-LINK: https://www.digikey.com/product-detail/en/ecs-inc/ECS-160-12-33Q-JES-TR/XC2147CT-ND/6050976; DISTRIBUTOR-PN: XC2147CT-ND; MANUFACTURER: ECS; MANUFACTURER-PN: ECS-160-12-33Q-JES-TR

## Module IMU
Ports: MOSI(in) SCK(in) MISO(out) INT(out) CS(in) +3V3(pwr) GND(pwr)
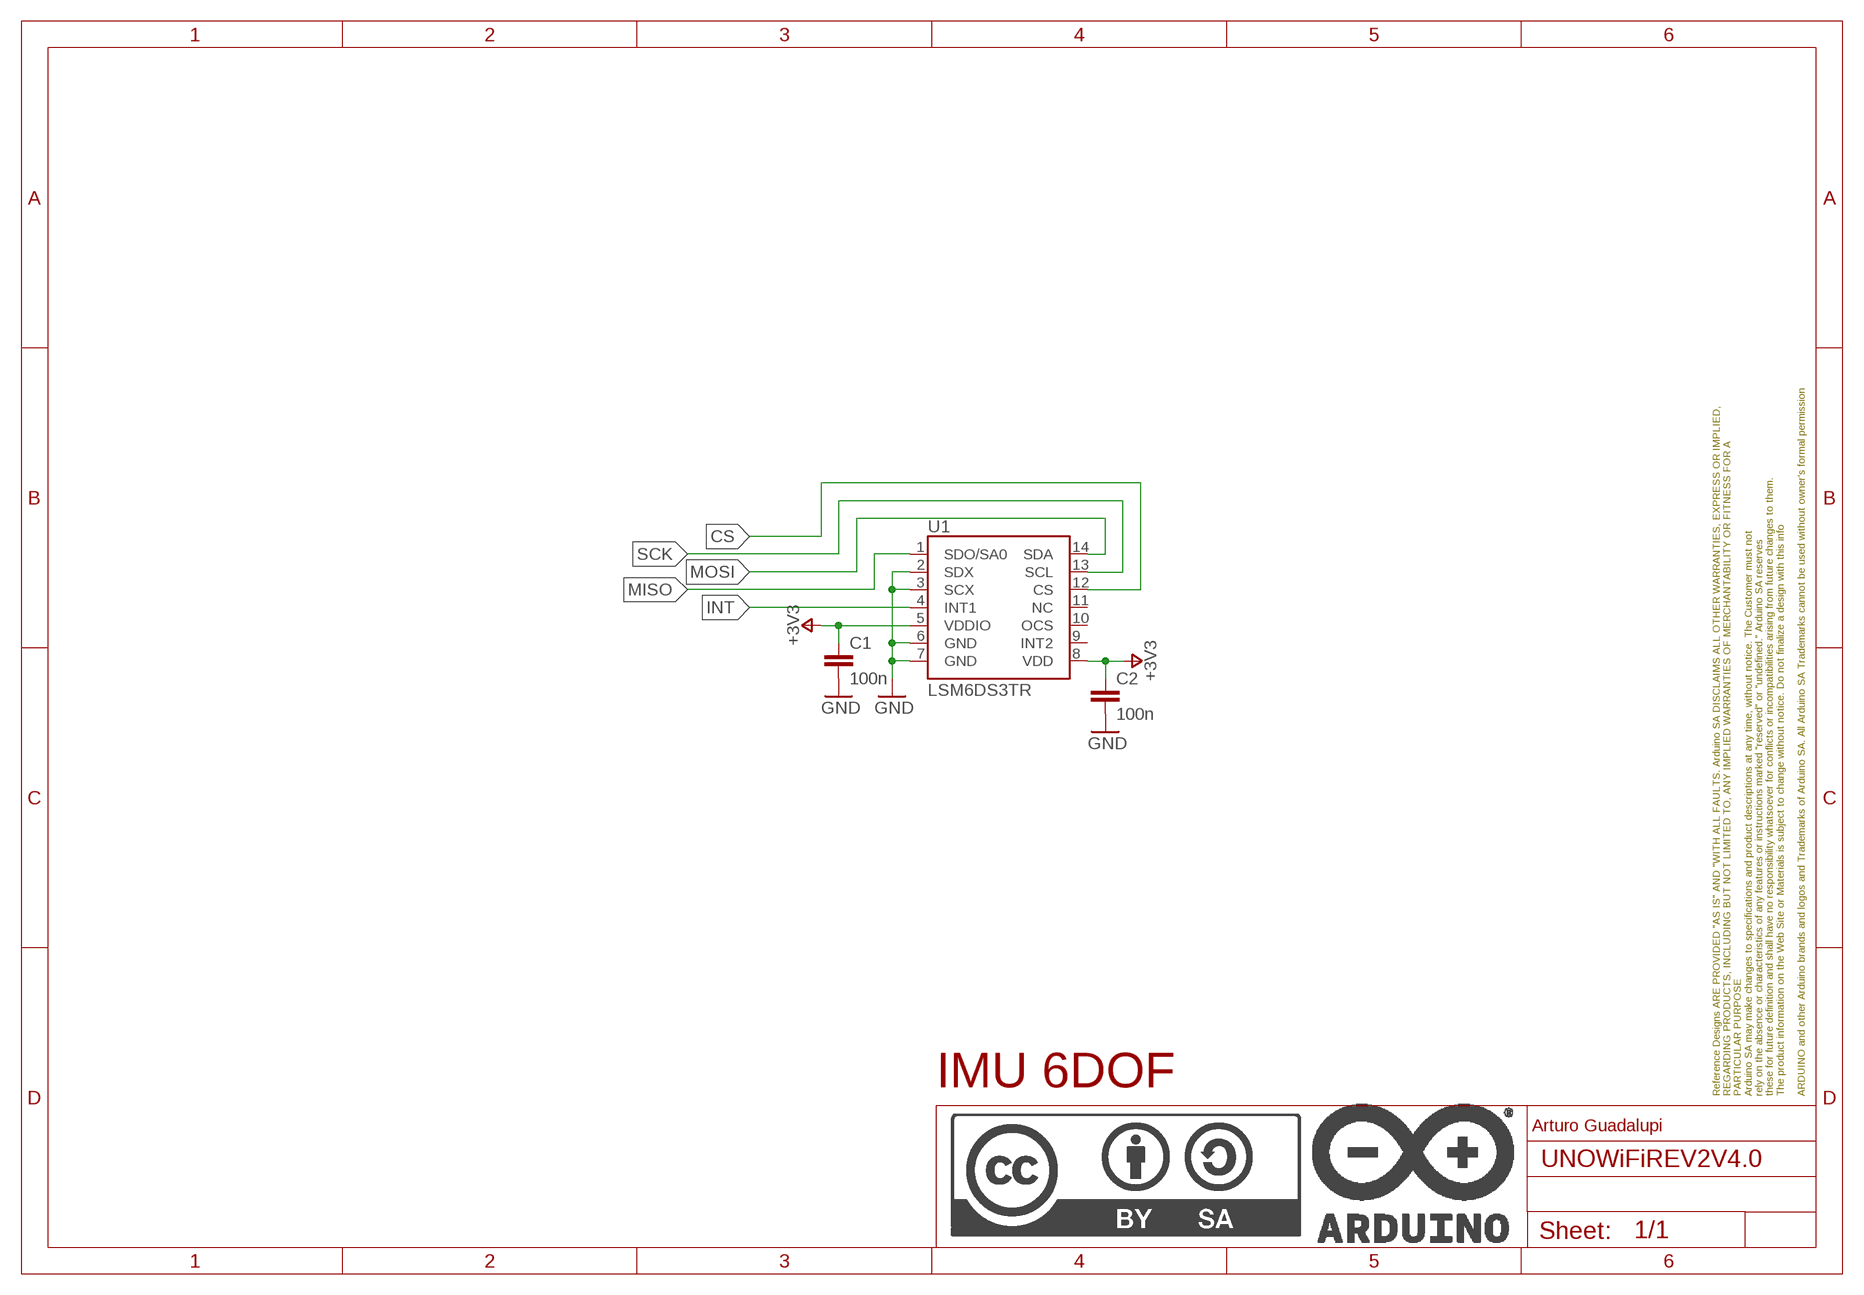
[diagram p4: schematic, module IMU, sheet 1]

### Parts
C1  100n  C-100NF-0402  [0402-1005X55N]
C2  100n  C-100NF-0402  [0402-1005X55N]
FRAME1  DNP  A4L-LOC  [FRAME]
U1  LSM6DS3TR  LSM6DS3LGA  [LGA14L]

### Nets
+3V3: C1.1 C2.1 U1.5(VDDIO) U1.8(VDD)
CS: U1.12(CS)
GND: C1.2 C2.2 U1.2(SDX) U1.3(SCX) U1.6(GND) U1.7(GND)
INT: U1.4(INT1)
MISO: U1.1(SDO/SA0)
MOSI: U1.14(SDA)
SCK: U1.13(SCL)
Unconnected: U1.9(INT2) U1.10(OCS) U1.11(NC)

### Notes on the sheet
- IMU 6DOF
- Arturo Guadalupi

### Library data of the parts
C1 C2 = Arduino-rcl:C: SMD Capacitor; CODE-ARDUINO: 0132; DATASHEET: http://www.tdk.com/pdf/TDKMLCCCapRange.pdf; DISTRIBUTOR-LINK: http://www.digikey.com/product-detail/en/tdk-corporation/C1005X5R1H104K050BB/445-5942-1-ND/2443982; DISTRIBUTOR-PN: 445-5942-1-ND; MANUFACTURER: TDK; MANUFACTURER-PN: C1005X5R1H104K050BB; NOTE: -
FRAME1 = Arduino-utility:A4L-LOC; CODE-ARDUINO: DNP; DATASHEET: DNP; DISTRIBUTOR-LINK: DNP; DISTRIBUTOR-PN: DNP; MANUFACTURER: DNP; MANUFACTURER-PN: DNP; NOTE: DNP
U1 = Arduino-Sensors:LSM6DS3: 6DOF IMU; CODE-ARDUINO: 2326; DATASHEET: https://www.st.com/content/ccc/resource/technical/document/datasheet/a3/f5/4f/ae/8e/44/41/d7/DM00133076.pdf/files/DM00133076.pdf/jcr:content/translations/en.DM00133076.pdf; DISTRIBUTOR-LINK: https://www.digikey.com/product-detail/en/stmicroelectronics/LSM6DS3TR/497-15383-1-ND/5180534; DISTRIBUTOR-PN: 497-15383-1-ND; MANUFACTURER: ST; MANUFACTURER-PN: LSM6DS3TR

## Module 2XTRANSLATOR
Ports: +3V3(pwr) B2(io) B1(io) A2(io) A1(io) +5V(pwr) GND(pwr)
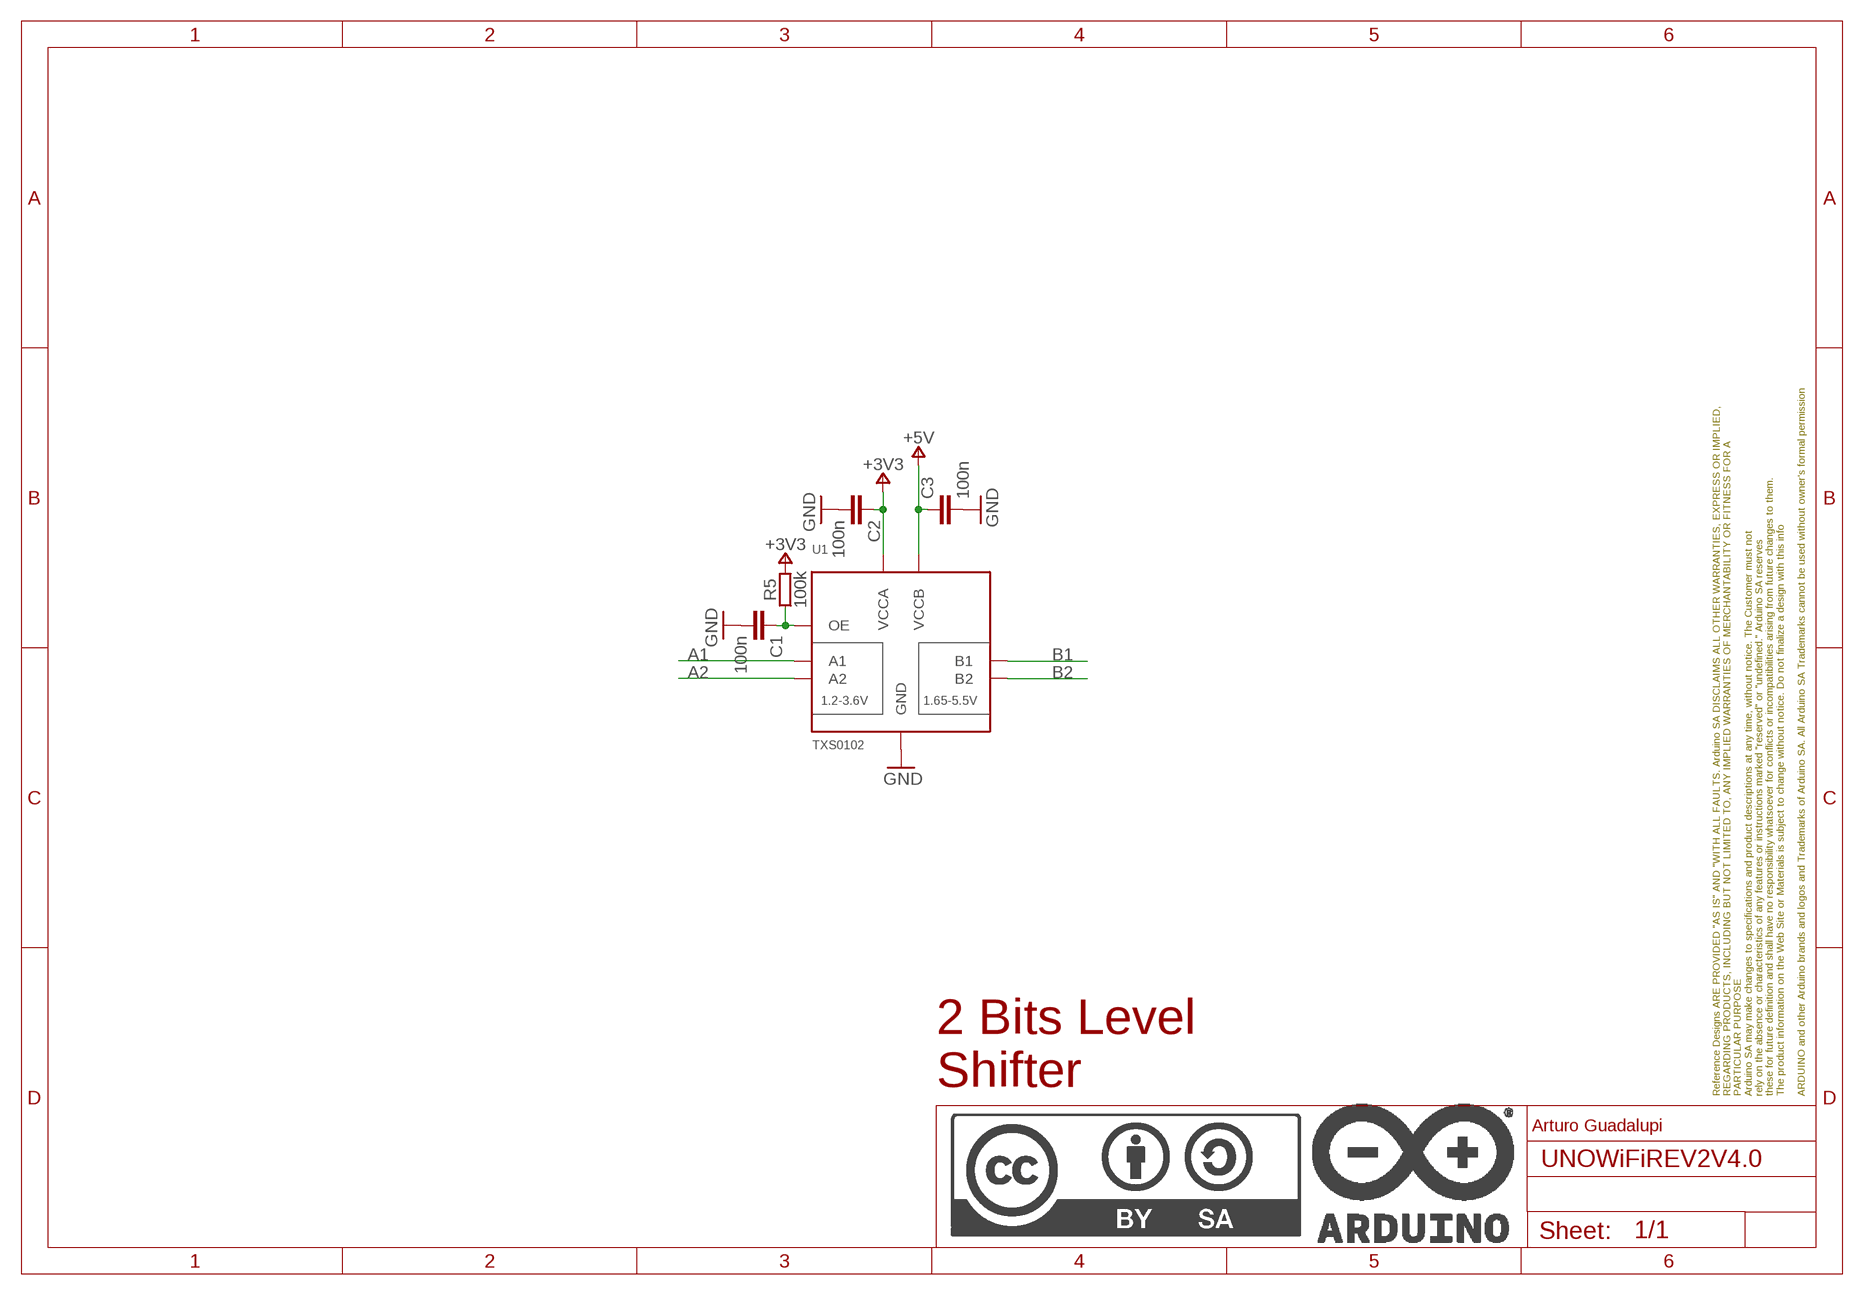
[diagram p5: schematic, module 2XTRANSLATOR, sheet 1]

### Parts
C1  100n  C-100NF-0402  [0402-1005X55N]
C2  100n  C-100NF-0402  [0402-1005X55N]
C3  100n  C-100NF-0402  [0402-1005X55N]
FRAME1  DNP  A4L-LOC  [FRAME]
R5  100k  R-100K-0402  [0402-1005X55N]
U1  TXS0102  [VFSOP-8]

### Nets
+3V3: C2.1 R5.2 U1.P$3(VCCA)
+5V: C3.1 U1.P$7(VCCB)
A1: U1.P$5(A1)
A2: U1.P$4(A2)
B1: U1.P$8(B1)
B2: U1.P$1(B2)
GND: C1.2 C2.2 C3.2 U1.P$2(GND)
N$1: C1.1 R5.1 U1.P$6(OE)

### Notes on the sheet
- 2 Bits Level
  Shifter
- Arturo Guadalupi

### Library data of the parts
C1-C3 = Arduino-rcl:C: SMD Capacitor; CODE-ARDUINO: 0132; DATASHEET: http://www.tdk.com/pdf/TDKMLCCCapRange.pdf; DISTRIBUTOR-LINK: http://www.digikey.com/product-detail/en/tdk-corporation/C1005X5R1H104K050BB/445-5942-1-ND/2443982; DISTRIBUTOR-PN: 445-5942-1-ND; MANUFACTURER: TDK; MANUFACTURER-PN: C1005X5R1H104K050BB; NOTE: -
FRAME1 = Arduino-utility:A4L-LOC; CODE-ARDUINO: DNP; DATASHEET: DNP; DISTRIBUTOR-LINK: DNP; DISTRIBUTOR-PN: DNP; MANUFACTURER: DNP; MANUFACTURER-PN: DNP; NOTE: DNP
R5 = Arduino-rcl:R: SMD Resistor; CODE-ARDUINO: 0134; DATASHEET: www.yageo.com.tw/exep/pages/download/literatures/PYu-R_INT-thick_7.pdf; DISTRIBUTOR-LINK: http://www.digikey.com/product-detail/en/yageo/RC0402FR-07100KL/311-100KLRCT-ND/729473; DISTRIBUTOR-PN: 311-100KLRCT-ND; MANUFACTURER: Yageo; MANUFACTURER-PN: RC0402FR-07100KL; NOTE: NO
U1 = Arduino-ICs:TXS0102: Voltage Level Translator Bidirectional 1 Circuit 2 Channel 24Mbps; CODE-ARDUINO: A5332; DATASHEET: http://www.ti.com/lit/ds/symlink/txs0102.pdf; DISTRIBUTOR-LINK: http://www.digikey.com/product-detail/en/texas-instruments/TXS0102DCURG4/296-41875-1-ND/5224578; DISTRIBUTOR-PN: 296-41875-1-ND; MANUFACTURER: Texas Instruments; MANUFACTURER-PN: TXS0102DCURG4; NOTE: NO

## Module WIFI/BLE
Ports: GPIO0(in) TX(out) RX(in) ACK(out) MISO(out) MOSI(in) SCK(in) CS(in) REMOTE_RST(out) SCL(in) SDA(io) +3V3(pwr) GND(pwr) RST(in) UPDI_REMOTE(io)
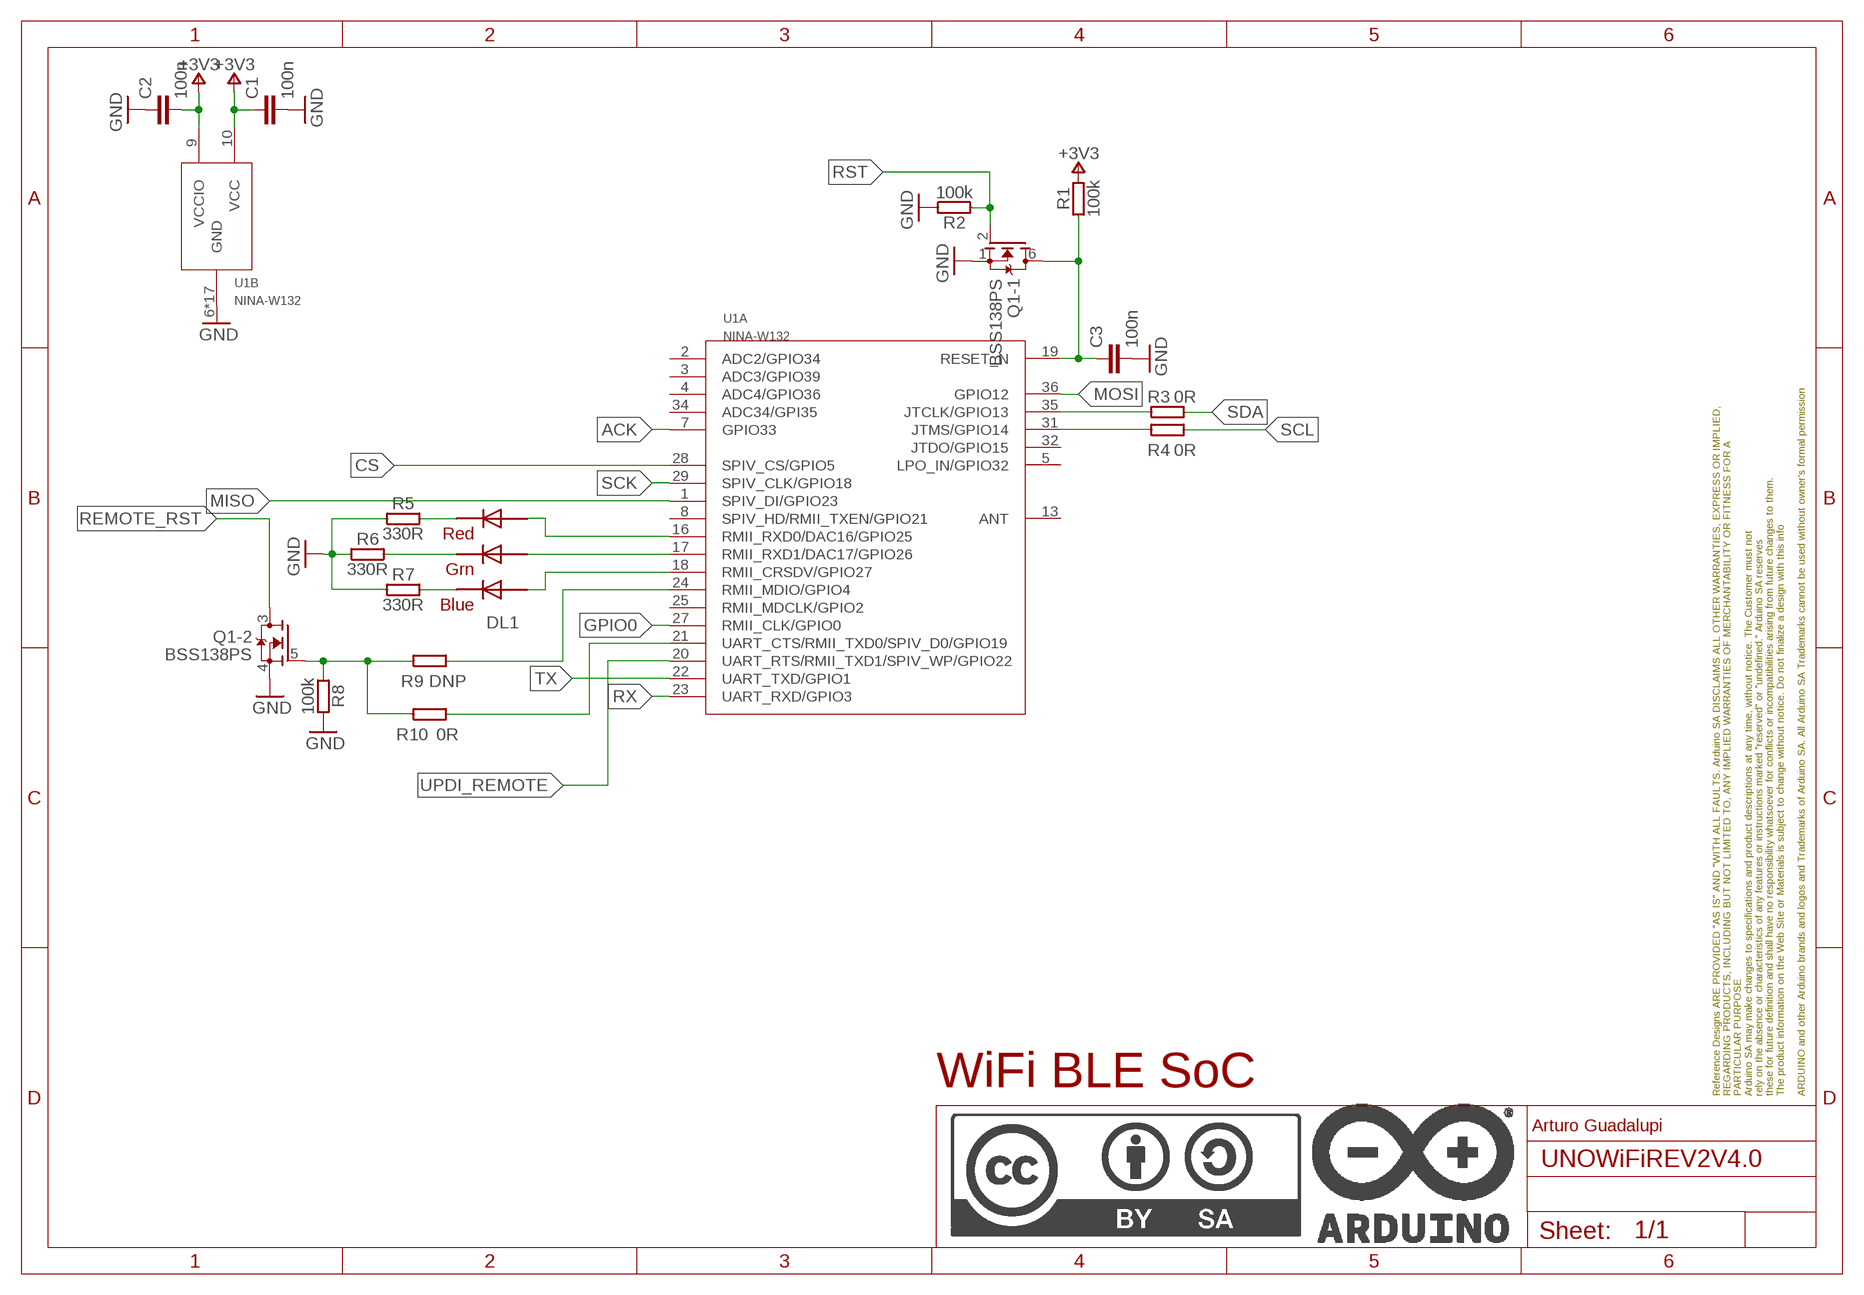
[diagram p6: schematic, module WIFI/BLE, sheet 1]

### Parts
C1  100n  C-100NF-0402  [0402-1005X55N]
C2  100n  C-100NF-0402  [0402-1005X55N]
C3  100n  C-100NF-0402  [0402-1005X55N]
DL1  RGB  RGBLED5050  [RGBLED]
FRAME1  DNP  A4L-LOC  [FRAME]
Q1  BSS138PS  [SOT363]
R1  100k  R-100K-0402  [0402-1005X55N]
R2  100k  R-100K-0402  [0402-1005X55N]
R3  0R  R-0R-0402  [0402-1005X55N]
R4  0R  R-0R-0402  [0402-1005X55N]
R5  330R  R-330R-0402  [0402-1005X55N]
R6  330R  R-330R-0402  [0402-1005X55N]
R7  330R  R-330R-0402  [0402-1005X55N]
R8  100k  R-100K-0402  [0402-1005X55N]
R9  DNP  R-DNP-0402  [0402-1005X55N]
R10  0R  R-0R-0402  [0402-1005X55N]
U1  NINA-W132  NINA-W1X-132  [NINA-W1X]

### Nets
+3V3: C1.1 C2.2 R1.2 U1.9(B:VCCIO) U1.10(B:VCC)
ACK: U1.7(A:GPIO33)
CS: U1.28(A:SPIV_CS/GPIO5)
GND: C1.2 C2.1 C3.2 Q1.1(-1:S) Q1.4(-2:S) R2.2 R5.1 R6.1 R7.1 R8.2 U1.6(B:GND) U1.12(B:GND) U1.14(B:GND) U1.26(B:GND) U1.30(B:GND) U1.GND@1(B:GND) U1.GND@2(B:GND) U1.GND@3(B:GND) U1.GND@4(B:GND) U1.GND@5(B:GND) U1.GND@6(B:GND) U1.GND@7(B:GND) U1.GND@8(B:GND) U1.GND@9(B:GND) U1.GND@10(B:GND) U1.GND@11(B:GND) U1.GND@12(B:GND)
GPIO0: U1.27(A:RMII_CLK/GPIO0)
MISO: U1.1(A:SPIV_DI/GPIO23)
MOSI: U1.36(A:GPIO12)
N$1: C3.1 Q1.6(-1:D) R1.1 U1.19(A:RESET_N)
N$2: R3.1 U1.35(A:JTCLK/GPIO13)
N$3: R4.1 U1.31(A:JTMS/GPIO14)
N$4: DL1.2(RED_A) U1.16(A:RMII_RXD0/DAC16/GPIO25)
N$5: DL1.1(GREEN_A) U1.17(A:RMII_RXD1/DAC17/GPIO26)
N$6: DL1.3(BLUE_A) U1.18(A:RMII_CRSDV/GPIO27)
N$7: DL1.5(RED_C) R5.2
N$8: DL1.6(GREEN_C) R6.2
N$9: DL1.4(BLUE_C) R7.2
N$10: R9.2 U1.24(A:RMII_MDIO/GPIO4)
N$11: Q1.5(-2:G) R8.1 R9.1 R10.1
N$12: R10.2 U1.21(A:UART_CTS/RMII_TXD0/SPIV_D0/GPIO19)
REMOTE_RST: Q1.3(-2:D)
RST: Q1.2(-1:G) R2.1
RX: U1.23(A:UART_RXD/GPIO3)
SCK: U1.29(A:SPIV_CLK/GPIO18)
SCL: R4.2
SDA: R3.2
TX: U1.22(A:UART_TXD/GPIO1)
UPDI_REMOTE: U1.20(A:UART_RTS/RMII_TXD1/SPIV_WP/GPIO22)
Unconnected: U1.2(A:ADC2/GPIO34) U1.3(A:ADC3/GPIO39) U1.4(A:ADC4/GPIO36) U1.5(A:LPO_IN/GPIO32) U1.8(A:SPIV_HD/RMII_TXEN/GPIO21) U1.13(A:ANT) U1.25(A:RMII_MDCLK/GPIO2) U1.32(A:JTDO/GPIO15) U1.34(A:ADC34/GPI35)

### Notes on the sheet
- WiFi BLE SoC
- Arturo Guadalupi

### Library data of the parts
C1-C3 = Arduino-rcl:C: SMD Capacitor; CODE-ARDUINO: 0132; DATASHEET: http://www.tdk.com/pdf/TDKMLCCCapRange.pdf; DISTRIBUTOR-LINK: http://www.digikey.com/product-detail/en/tdk-corporation/C1005X5R1H104K050BB/445-5942-1-ND/2443982; DISTRIBUTOR-PN: 445-5942-1-ND; MANUFACTURER: TDK; MANUFACTURER-PN: C1005X5R1H104K050BB; NOTE: -
DL1 = Arduino-diodes:RGBLED: 5050 RGB LED; CODE-ARDUINO: 2211; DATASHEET: http://www.osram-os.com/Graphics/XPic9/00134830_0.pdf; DISTRIBUTOR-LINK: https://www.digikey.com/product-detail/en/osram-opto-semiconductors-inc/LTRBGFSF-ABCB-QKYO-Z/475-2899-1-ND/2415091; DISTRIBUTOR-PN: 475-2899-1-ND; MANUFACTURER: OSRAM Opto Semiconductors Inc.; MANUFACTURER-PN: LTRBGFSF-ABCB-QKYO-Z
FRAME1 = Arduino-utility:A4L-LOC; CODE-ARDUINO: DNP; DATASHEET: DNP; DISTRIBUTOR-LINK: DNP; DISTRIBUTOR-PN: DNP; MANUFACTURER: DNP; MANUFACTURER-PN: DNP; NOTE: DNP
Q1 = Arduino-transistors:BSS138PS: MOSFET 2N-CH 60V 0.32A 6TSSOP; CODE-ARDUINO: 2323; DATASHEET: https://assets.nexperia.com/documents/data-sheet/BSS138PS.pdf; DISTRIBUTOR-LINK: http://www.digikey.com/product-detail/en/nxp-semiconductors/BSS138PS,115/568-8393-1-ND/2763927; DISTRIBUTOR-PN: 568-8393-1-ND; MANUFACTURER: NXP; MANUFACTURER-PN: BSS138PS,115
R1 R2 R8 = Arduino-rcl:R: SMD Resistor; CODE-ARDUINO: 0134; DATASHEET: www.yageo.com.tw/exep/pages/download/literatures/PYu-R_INT-thick_7.pdf; DISTRIBUTOR-LINK: http://www.digikey.com/product-detail/en/yageo/RC0402FR-07100KL/311-100KLRCT-ND/729473; DISTRIBUTOR-PN: 311-100KLRCT-ND; MANUFACTURER: Yageo; MANUFACTURER-PN: RC0402FR-07100KL; NOTE: NO
R3 R4 R10 = Arduino-rcl:R: SMD Resistor; CODE-ARDUINO: 0039; DATASHEET: www.yageo.com.tw/exep/pages/download/literatures/PYu-R_INT-thick_7.pdf; DISTRIBUTOR-LINK: http://www.digikey.com/product-detail/en/yageo/RC0402FR-070RL/311-0.0LRCT-ND/2827888; DISTRIBUTOR-PN: 311-0.0LRCT-ND; MANUFACTURER: Yageo; MANUFACTURER-PN: RC0402FR-070RL; NOTE: NO
R5-R7 = Arduino-rcl:R: SMD Resistor; CODE-ARDUINO: 2229; DATASHEET: www.yageo.com.tw/exep/pages/download/literatures/PYu-R_INT-thick_7.pdf; DISTRIBUTOR-LINK: http://www.digikey.com/product-detail/en/yageo/RC0402FR-07330RL/311-330LRCT-ND/729541; DISTRIBUTOR-PN: 311-330LRCT-ND; MANUFACTURER: Yageo; MANUFACTURER-PN: RC0402FR-07330RL; NOTE: NO
R9 = Arduino-rcl:R: SMD Resistor; CODE-ARDUINO: DNP; DATASHEET: DNP; DISTRIBUTOR-LINK: DNP; DISTRIBUTOR-PN: DNP; MANUFACTURER: DNP; MANUFACTURER-PN: DNP; NOTE: NO
U1 = Arduino-ucs&SoCs:NINA-W1X: ESP32 WiFi/BLE module; CODE-ARDUINO: NINA-W132; DATASHEET: https://www.u-blox.com/sites/default/files/NINA-W1_DataSheet_%28UBX-17006694%29.pdf; DISTRIBUTOR-LINK: https://www.digikey.com/product-detail/en/u-blox-america-inc/NINA-W132/672-1072-1-ND/7931822; DISTRIBUTOR-PN: 672-1072-1-ND; MANUFACTURER: Ublocks; MANUFACTURER-PN: NINA-W132

## Module PWR
Ports: GND(pwr) +3V3(pwr) VUSB(pwr) VIN_EXT(pwr) +5V(pwr)
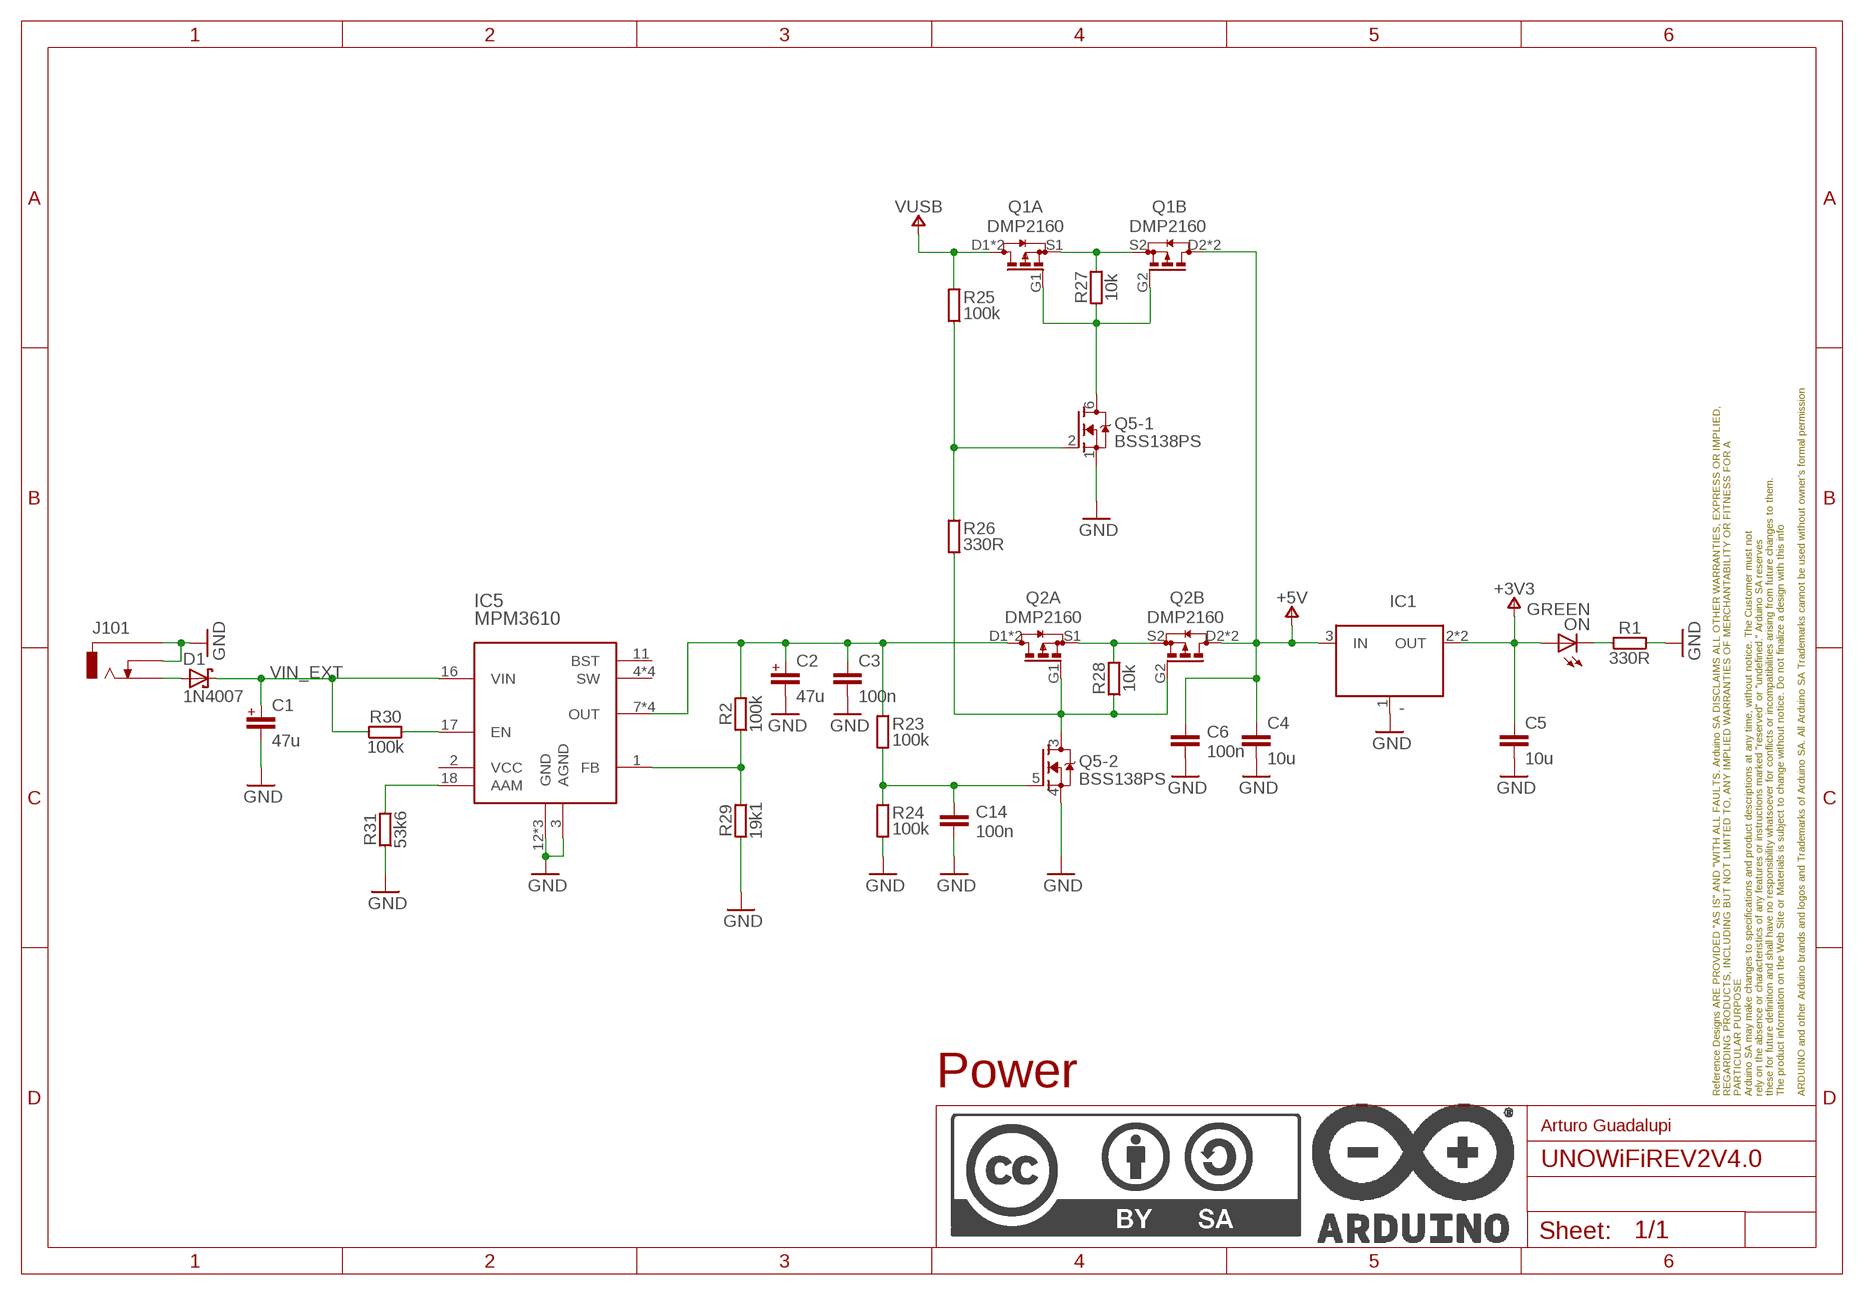
[diagram p7: schematic, module PWR, sheet 1]

### Parts
C1  47u  C+-47UFPAN-D  [PANASONIC_D]
C2  47u  C+-47UFPAN-D  [PANASONIC_D]
C3  100n  C-100NF-0402  [0402-1005X55N]
C4  10u  C-10UF-0603  [0603-1608X90N]
C5  10u  C-10UF-0603  [0603-1608X90N]
C6  100n  C-100NF-0402  [0402-1005X55N]
C14  100n  C-100NF-0402  [0402-1005X55N]
D1  1N4007  D_SCHOTTKY-4007-SMB  [SMB_DO214AA]
FRAME1  DNP  A4L-LOC  [FRAME]
IC1  -  LDO-3.3T3SOT223  [SOT223]
IC5  MPM3610  [MPM3610]
J101  -  BARRELLG  [POWERSUPPLY_DC-21MM]
ON  GREEN  LED-GREEN-0603  [LEDC1608X80N-AK]
Q1  DMP2160  DMP2160UFDB  [PWR_SC70]
Q2  DMP2160  DMP2160UFDB  [PWR_SC70]
Q5  BSS138PS  [SOT363]
R1  330R  R-330R-0402  [0402-1005X55N]
R2  100k  R-100K-0402  [0402-1005X55N]
R23  100k  R-100K-0402  [0402-1005X55N]
R24  100k  R-100K-0402  [0402-1005X55N]
R25  100k  R-100K-0402  [0402-1005X55N]
R26  330R  R-330R-0402  [0402-1005X55N]
R27  10k  R-10K-0402  [0402-1005X55N]
R28  10k  R-10K-0402  [0402-1005X55N]
R29  19k1  R-19K1-0402  [0402-1005X55N]
R30  100k  R-100K-0402  [0402-1005X55N]
R31  53k6  R-53K6-0402  [0402-1005X55N]

### Nets
+3V3: C5.1 IC1.2(OUT) IC1.4(OUT) ON.A
+5V: C4.1 C6.1 IC1.3(IN) Q1.D2'(B:D) Q1.D2(B:D) Q2.D2'(B:D) Q2.D2(B:D)
GND: C1.- C2.- C3.2 C4.2 C5.2 C6.2 C14.2 IC1.1(GND/ADJ) IC5.3(AGND) IC5.12(GND) IC5.13(GND) IC5.14(GND) J101.-1 J101.-2 J101.-3 J101.E1 J101.E2 J101.E3 Q5.1(-1:S) Q5.4(-2:S) R1.2 R24.1 R29.1 R31.1
N17690335: Q1.S1(A:S) Q1.S2(B:S) R27.2
N17690346: Q1.G1(A:G) Q1.G2(B:G) Q5.6(-1:D) R27.1
N17690381: Q5.2(-1:G) R25.1 R26.2
N17690821: Q2.S1(A:S) Q2.S2(B:S) R28.2
N17690840: Q2.G1(A:G) Q2.G2(B:G) Q5.3(-2:D) R26.1 R28.1
N17690878: C14.1 Q5.5(-2:G) R23.1 R24.2
N$1: D1.A J101.+1 J101.+2 J101.+3
N$3: C2.+ C3.1 IC5.7(OUT) IC5.8(OUT) IC5.9(OUT) IC5.20(OUT) Q2.D1'(A:D) Q2.D1(A:D) R2.2 R23.2
N$4: ON.C R1.1
N$35: IC5.1(FB) R2.1 R29.2
N$36: IC5.17(EN) R30.2
N$37: IC5.18(AAM) R31.2
VIN_EXT: C1.+ D1.C IC5.16(VIN) R30.1
VUSB: Q1.D1'(A:D) Q1.D1(A:D) R25.2
Unconnected: IC5.2(VCC) IC5.4(SW) IC5.5(SW) IC5.6(SW) IC5.11(BST) IC5.19(SW)

### Notes on the sheet
- Power
- Arturo Guadalupi

### Library data of the parts
C1 C2 = Arduino-rcl:C+: Polarized Capacitor; CODE-ARDUINO: 0113; DATASHEET: https://industrial.panasonic.com/cdbs/www-data/pdf/RDE0000/DME0000COL90.pdf; DISTRIBUTOR-LINK: https://www.digikey.com/product-detail/en/panasonic-electronic-components/EEE-1EA470WP/PCE3908CT-ND/766284; DISTRIBUTOR-PN: PCE3908CT-ND; MANUFACTURER: Panasonic; MANUFACTURER-PN: EEE-1EA470WP; PN-ALTERNATIVE1: TS13C01E470MET000R
C3 C6 C14 = Arduino-rcl:C: SMD Capacitor; CODE-ARDUINO: 0132; DATASHEET: http://www.tdk.com/pdf/TDKMLCCCapRange.pdf; DISTRIBUTOR-LINK: http://www.digikey.com/product-detail/en/tdk-corporation/C1005X5R1H104K050BB/445-5942-1-ND/2443982; DISTRIBUTOR-PN: 445-5942-1-ND; MANUFACTURER: TDK; MANUFACTURER-PN: C1005X5R1H104K050BB; NOTE: -
C4 C5 = Arduino-rcl:C: SMD Capacitor; CODE-ARDUINO: 2213; DATASHEET: http://www.murata.com/~/media/webrenewal/support/library/catalog/products/capacitor/mlcc/c02e.pdf; DISTRIBUTOR-LINK: http://www.digikey.com/product-search/en?keywords=490-10728-1-ND; DISTRIBUTOR-PN: 490-10728-1-ND; MANUFACTURER: Murata; MANUFACTURER-PN: GRM188R61C106KAALD; NOTE: -
D1 = Arduino-diodes:D_SCHOTTKY: Schottky Diodes; CODE-ARDUINO: 0020; DATASHEET: www.comchiptech.com/cms/UserFiles/CGRA4001-G%20Thru.%20CGRA4007-HF%20RevD.pdf; DISTRIBUTOR-LINK: https://www.digikey.com/product-detail/en/comchip-technology/CGRA4007-G/641-1018-1-ND/1121140; DISTRIBUTOR-PN: 641-1018-1-ND; MANUFACTURER: Comchip; MANUFACTURER-PN: CGRA4007-G; PN-ALTERNATIVE1: 1N4007SMA
FRAME1 = Arduino-utility:A4L-LOC; CODE-ARDUINO: DNP; DATASHEET: DNP; DISTRIBUTOR-LINK: DNP; DISTRIBUTOR-PN: DNP; MANUFACTURER: DNP; MANUFACTURER-PN: DNP; NOTE: DNP
IC1 = Arduino-ICs:LDO: LDO; CODE-ARDUINO: 0045; DATASHEET: https://media.digikey.com/pdf/Data%20Sheets/NXP%20PDFs/NX1117C(E).pdf; DISTRIBUTOR-LINK: https://www.digikey.com/product-detail/en/nxp-usa-inc/NX1117CE33Z,115/568-8443-1-ND/2765160; DISTRIBUTOR-PN: 568-8443-1-ND; MANUFACTURER: NXP; MANUFACTURER-PN: NX1117CE33Z,115; NOTE: NO
IC5 = Arduino-ICs:MPM3610: MPM3610 Step Down Regulator; CODE-ARDUINO: 2093; DATASHEET: https://www.monolithicpower.com/pub/media/document/MPM3610_r1.01.pdf; DISTRIBUTOR-LINK: https://www.digikey.com/product-detail/en/monolithic-power-systems-inc/MPM3610AGQV-P/1589-1249-1-ND/5298336; DISTRIBUTOR-PN: 1589-1249-1-ND; MANUFACTURER: MPS; MANUFACTURER-PN: MPM3610AGQV-P; RESTRICTIONS: NO
J101 = Arduino-connectors:BARREL: Power Barrel Connector Jack 2.10mm ID (0.083"), 5.50mm OD (0.217") Through Hole, Right Angle; CODE-ARDUINO: 0018; DATASHEET: http://www.mouser.com/ds/2/253/KC-301287-195995.pdf; DISTRIBUTOR-LINK: https://www.mouser.it/ProductDetail/Kobiconn/163-179PH-EX/?qs=Xb8IjHhkxj5l2UOaIqcGCw==; DISTRIBUTOR-PN: 163-179PH-EX; MANUFACTURER: Kobiconn; MANUFACTURER-PN: 163-179PH-EX
ON = Arduino-diodes:LED: LED; CODE-ARDUINO: 2204; DATASHEET: http://media.digikey.com/pdf/Data%20Sheets/Avago%20PDFs/HSMz-Czzz.pdf; DISTRIBUTOR-LINK: http://www.digikey.com/product-detail/en/broadcom-limited/HSMG-C190/516-1425-1-ND/637749; DISTRIBUTOR-PN: 516-1425-1-ND; MANUFACTURER: Avago; MANUFACTURER-PN: HSMG-C190
Q1 Q2 = Arduino-transistors:DMP2160UFDB: MOSFET 2P-CH 20V 3.8A 6UDFN; CODE-ARDUINO: 2324; DATASHEET: http://www.diodes.com/_files/datasheets/ds31643.pdf; DISTRIBUTOR-LINK: http://www.digikey.com/product-detail/en/diodes-incorporated/DMP2160UFDB-7/DMP2160UFDB-7DI-ND/4249940; DISTRIBUTOR-PN: DMP2160UFDB-7DI-ND; MANUFACTURER: Diodes Inc; MANUFACTURER-PN: DMP2160UFDB-7
Q5 = Arduino-transistors:BSS138PS: MOSFET 2N-CH 60V 0.32A 6TSSOP; CODE-ARDUINO: 2323; DATASHEET: https://assets.nexperia.com/documents/data-sheet/BSS138PS.pdf; DISTRIBUTOR-LINK: http://www.digikey.com/product-detail/en/nxp-semiconductors/BSS138PS,115/568-8393-1-ND/2763927; DISTRIBUTOR-PN: 568-8393-1-ND; MANUFACTURER: NXP; MANUFACTURER-PN: BSS138PS,115
R1 R26 = Arduino-rcl:R: SMD Resistor; CODE-ARDUINO: 2229; DATASHEET: www.yageo.com.tw/exep/pages/download/literatures/PYu-R_INT-thick_7.pdf; DISTRIBUTOR-LINK: http://www.digikey.com/product-detail/en/yageo/RC0402FR-07330RL/311-330LRCT-ND/729541; DISTRIBUTOR-PN: 311-330LRCT-ND; MANUFACTURER: Yageo; MANUFACTURER-PN: RC0402FR-07330RL; NOTE: NO
R2 R23-R25 R30 = Arduino-rcl:R: SMD Resistor; CODE-ARDUINO: 0134; DATASHEET: www.yageo.com.tw/exep/pages/download/literatures/PYu-R_INT-thick_7.pdf; DISTRIBUTOR-LINK: http://www.digikey.com/product-detail/en/yageo/RC0402FR-07100KL/311-100KLRCT-ND/729473; DISTRIBUTOR-PN: 311-100KLRCT-ND; MANUFACTURER: Yageo; MANUFACTURER-PN: RC0402FR-07100KL; NOTE: NO
R27 R28 = Arduino-rcl:R: SMD Resistor; CODE-ARDUINO: 0136; DATASHEET: www.yageo.com.tw/exep/pages/download/literatures/PYu-R_INT-thick_7.pdf; DISTRIBUTOR-LINK: http://www.digikey.com/product-detail/en/yageo/RC0402FR-0710KL/311-10.0KLRCT-ND/729470; DISTRIBUTOR-PN: 311-10.0KLRCT-ND; MANUFACTURER: Yageo; MANUFACTURER-PN: RC0402FR-0710KL; NOTE: NO
R29 = Arduino-rcl:R: SMD Resistor; CODE-ARDUINO: A5369; DATASHEET: http://www.yageo.com/documents/recent/PYu-RC_Group_51_RoHS_L_10.pdf; DISTRIBUTOR-LINK: https://www.digikey.it/product-detail/it/yageo/RC0402FR-0719K1L/311-19.1KLRTR-ND/726552; DISTRIBUTOR-PN: 311-19.1KLRTR-ND; MANUFACTURER: Yageo; MANUFACTURER-PN: RC0402FR-0719K1L; NOTE: NO
R31 = Arduino-rcl:R: SMD Resistor; CODE-ARDUINO: A5313; DATASHEET: www.yageo.com.tw/exep/pages/download/literatures/PYu-R_INT-thick_7.pdf; DISTRIBUTOR-LINK: https://www.digikey.com/product-detail/en/yageo/RC0402FR-0753K6L/311-53.6KLRCT-ND/729581; DISTRIBUTOR-PN: 311-53.6KLRCT-ND; MANUFACTURER: Yageo; MANUFACTURER-PN: RC0402FR-0753K6L; NOTE: 1% ONLY

## Module 16XTRANSLATOR
Ports: +5V(pwr) +3V3(pwr) GND(pwr) YB2(in) YA2(out) XB3(out) XA3(in) XA2(in) XB2(out) XB5(out) XA5(in) XA6(in) XB6(out) YA3(out) YB3(in) YB4(in) YA4(out) YA1(out) YB1(in) YB0(in) YA0(out) XB7(out) XA7(in)
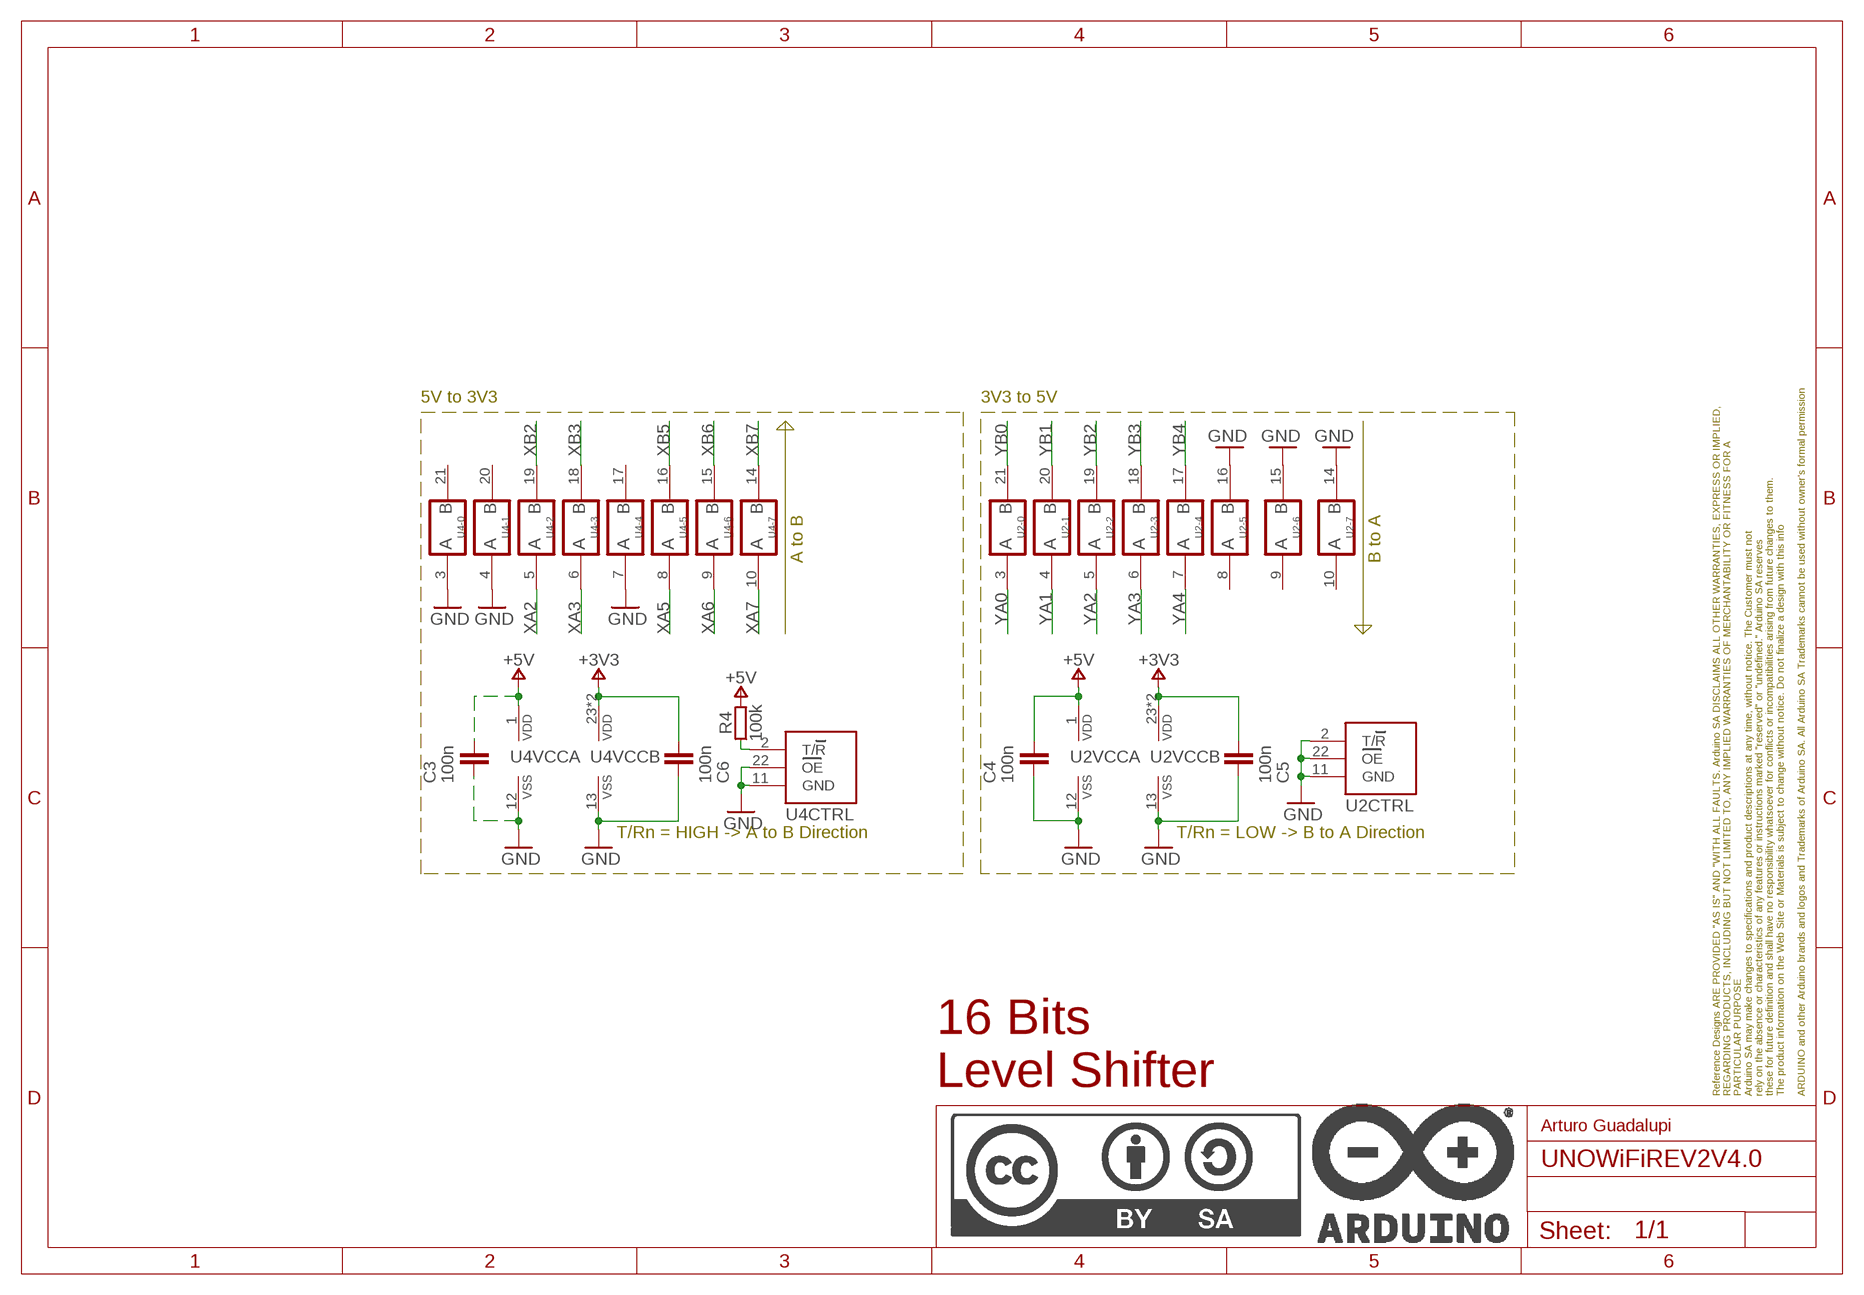
[diagram p8: schematic, module 16XTRANSLATOR, sheet 1]

### Parts
C3  100n  C-100NF-0402  [0402-1005X55N]
C4  100n  C-100NF-0402  [0402-1005X55N]
C5  100n  C-100NF-0402  [0402-1005X55N]
C6  100n  C-100NF-0402  [0402-1005X55N]
FRAME1  DNP  A4L-LOC  [FRAME]
R4  100k  R-100K-0402  [0402-1005X55N]
U2  MC74LVX4245  [TSSOP24]
U4  MC74LVX4245  [TSSOP24]

### Nets
+3V3: C5.1 C6.1 U2.23(VCCB:VDD) U2.24(VCCB:VDD) U4.23(VCCB:VDD) U4.24(VCCB:VDD)
+5V: C3.1 C4.1 R4.2 U2.1(VCCA:VDD) U4.1(VCCA:VDD)
GND: C3.2 C4.2 C5.2 C6.2 U2.2(CTRL:T/R) U2.11(CTRL:GND) U2.12(VCCA:VSS) U2.13(VCCB:VSS) U2.14(-7:O) U2.15(-6:O) U2.16(-5:O) U2.22(CTRL:OE) U4.3(-0:I) U4.4(-1:I) U4.7(-4:I) U4.11(CTRL:GND) U4.12(VCCA:VSS) U4.13(VCCB:VSS) U4.22(CTRL:OE)
N$1: R4.1 U4.2(CTRL:T/R)
XA2: U4.5(-2:I)
XA3: U4.6(-3:I)
XA5: U4.8(-5:I)
XA6: U4.9(-6:I)
XA7: U4.10(-7:I)
XB2: U4.19(-2:O)
XB3: U4.18(-3:O)
XB5: U4.16(-5:O)
XB6: U4.15(-6:O)
XB7: U4.14(-7:O)
YA0: U2.3(-0:I)
YA1: U2.4(-1:I)
YA2: U2.5(-2:I)
YA3: U2.6(-3:I)
YA4: U2.7(-4:I)
YB0: U2.21(-0:O)
YB1: U2.20(-1:O)
YB2: U2.19(-2:O)
YB3: U2.18(-3:O)
YB4: U2.17(-4:O)
Unconnected: U2.8(-5:I) U2.9(-6:I) U2.10(-7:I) U4.17(-4:O) U4.20(-1:O) U4.21(-0:O)

### Notes on the sheet
- 5V to 3V3 | 3V3 to 5V
- A to B | B to A
- T/Rn = HIGH -> A to B Direction | T/Rn = LOW -> B to A Direction
- 16 Bits 
  Level Shifter
- Arturo Guadalupi

### Library data of the parts
C3-C6 = Arduino-rcl:C: SMD Capacitor; CODE-ARDUINO: 0132; DATASHEET: http://www.tdk.com/pdf/TDKMLCCCapRange.pdf; DISTRIBUTOR-LINK: http://www.digikey.com/product-detail/en/tdk-corporation/C1005X5R1H104K050BB/445-5942-1-ND/2443982; DISTRIBUTOR-PN: 445-5942-1-ND; MANUFACTURER: TDK; MANUFACTURER-PN: C1005X5R1H104K050BB; NOTE: -
FRAME1 = Arduino-utility:A4L-LOC; CODE-ARDUINO: DNP; DATASHEET: DNP; DISTRIBUTOR-LINK: DNP; DISTRIBUTOR-PN: DNP; MANUFACTURER: DNP; MANUFACTURER-PN: DNP; NOTE: DNP
R4 = Arduino-rcl:R: SMD Resistor; CODE-ARDUINO: 0134; DATASHEET: www.yageo.com.tw/exep/pages/download/literatures/PYu-R_INT-thick_7.pdf; DISTRIBUTOR-LINK: http://www.digikey.com/product-detail/en/yageo/RC0402FR-07100KL/311-100KLRCT-ND/729473; DISTRIBUTOR-PN: 311-100KLRCT-ND; MANUFACTURER: Yageo; MANUFACTURER-PN: RC0402FR-07100KL; NOTE: NO
U2 U4 = Arduino-ICs:MC74LVX4245: Dual Supply Octal Translating Transceiver; CODE-ARDUINO: A5327; DATASHEET: http://www.onsemi.com/pub/Collateral/MC74LVX4245-D.PDF; DISTRIBUTOR-LINK: https://www.digikey.com/product-detail/en/on-semiconductor/MC74LVX4245DTR2G/MC74LVX4245DTR2GOSCT-ND/2120954; DISTRIBUTOR-PN: MC74LVX4245DTR2GOSCT-ND; MANUFACTURER: ON Semiconductor; MANUFACTURER-PN: MC74LVX4245DTR2G; NOTE: NO

## Net classes
0 default: width 0.006 mm, drill 0.305 mm